# EAGLE schematic PinHeck (EAGLE 6.5.0)
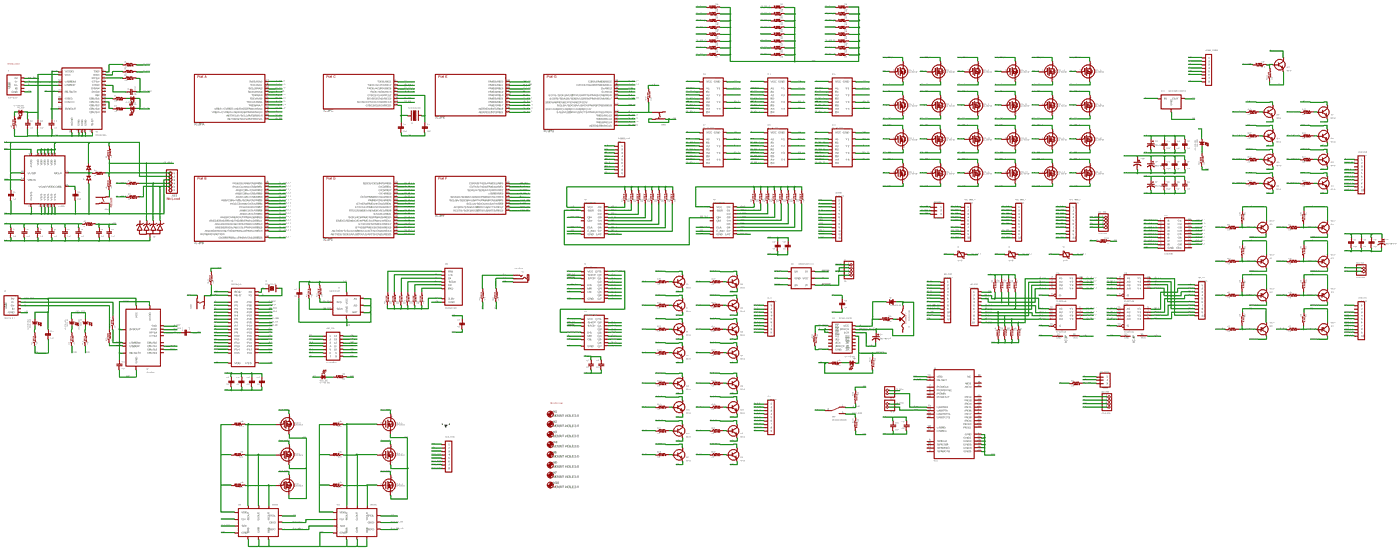
[diagram p0: schematic, sheet 1, overview]
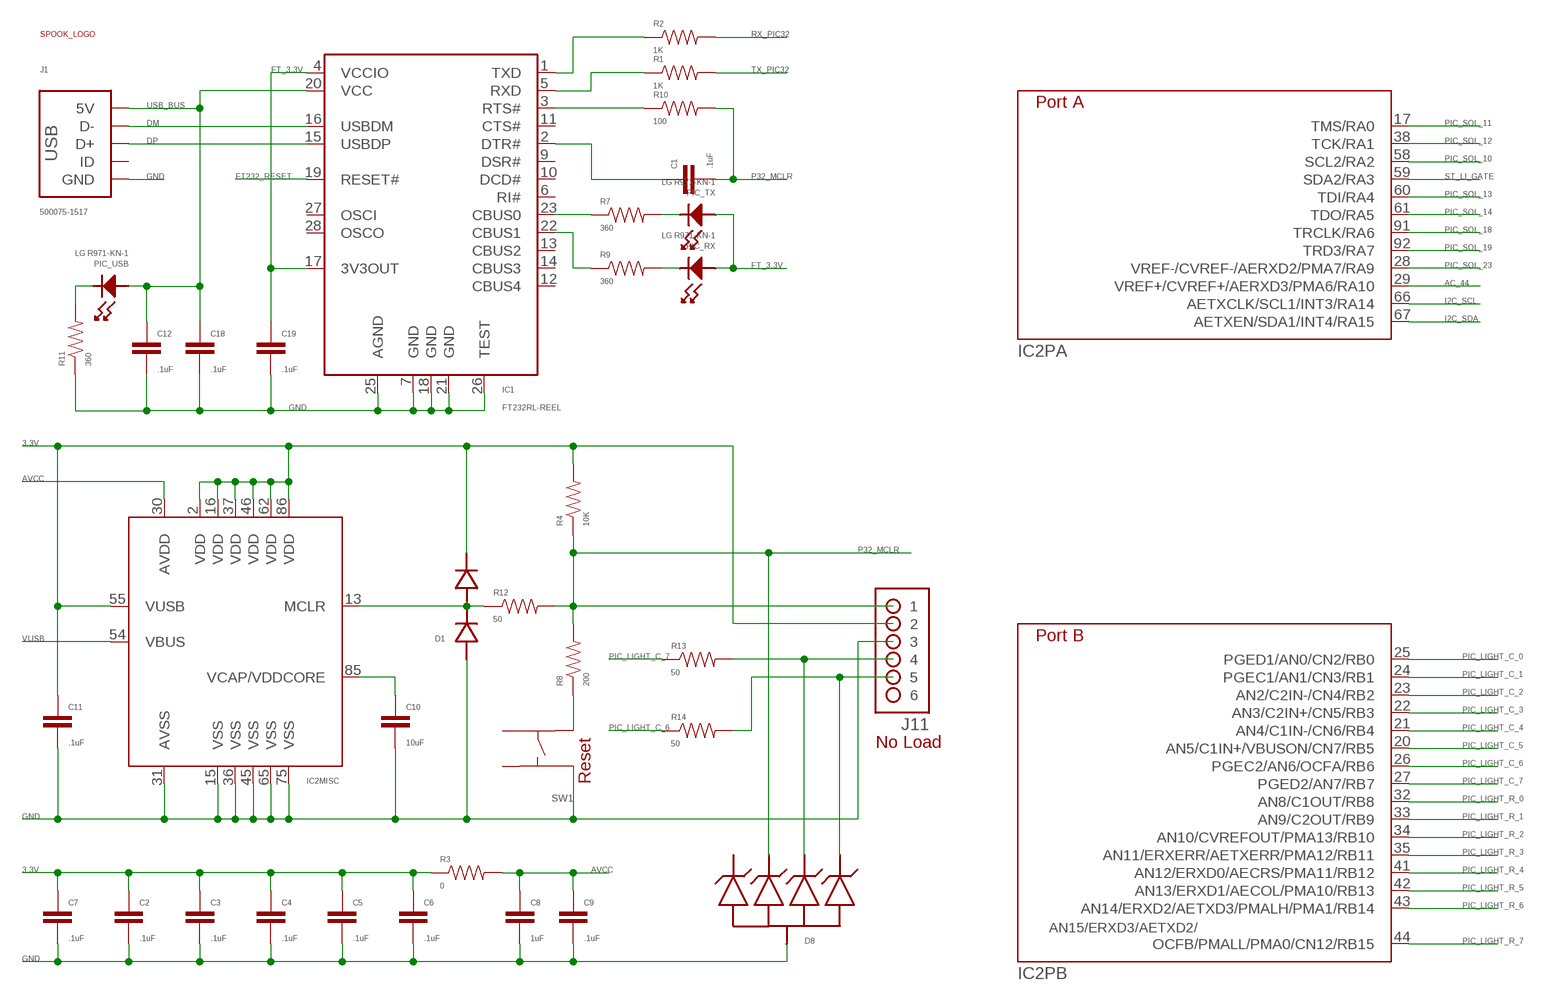
[diagram p1: schematic, sheet 1, part 1 of 9]
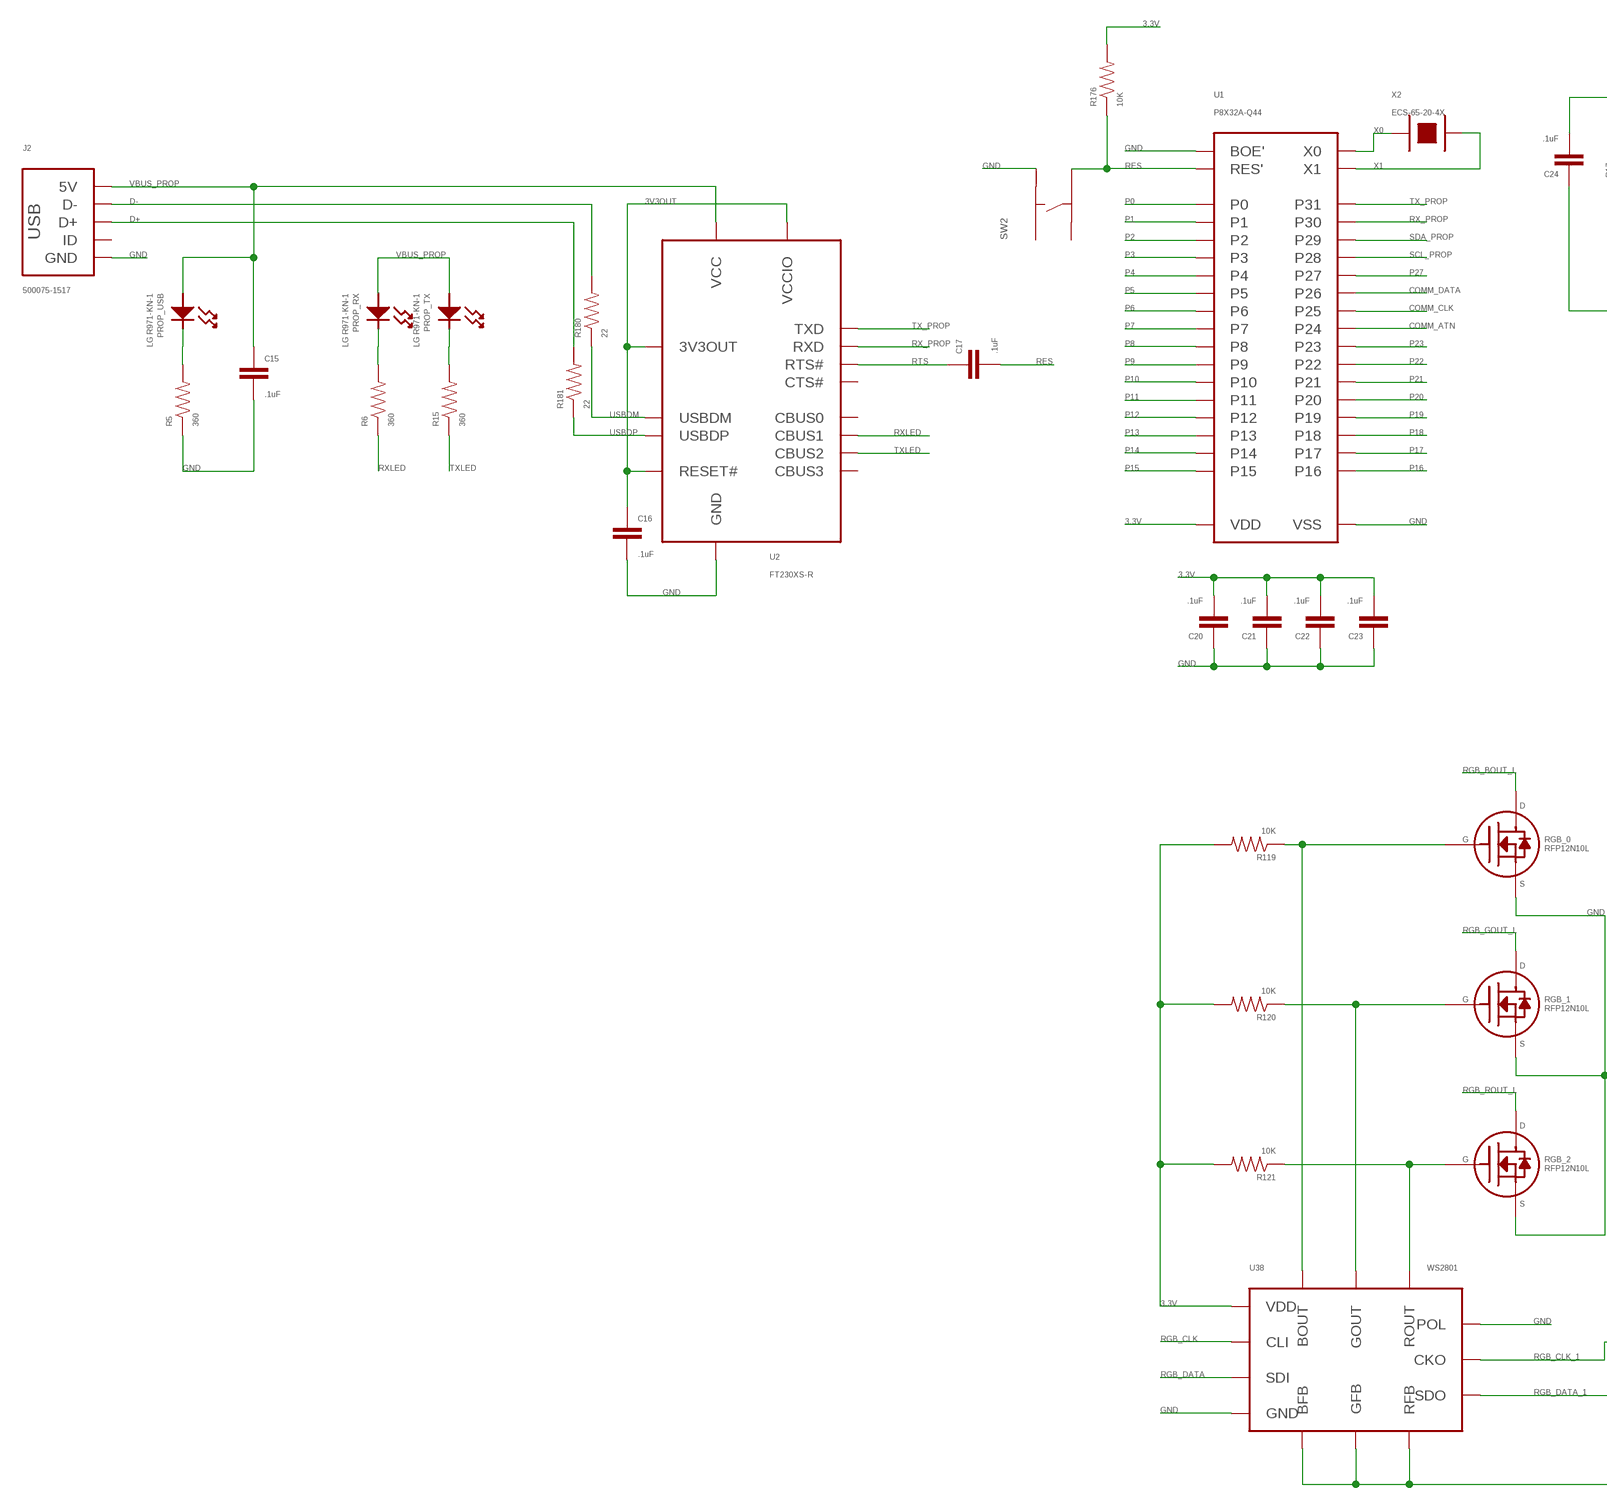
[diagram p2: schematic, sheet 1, part 2 of 9]
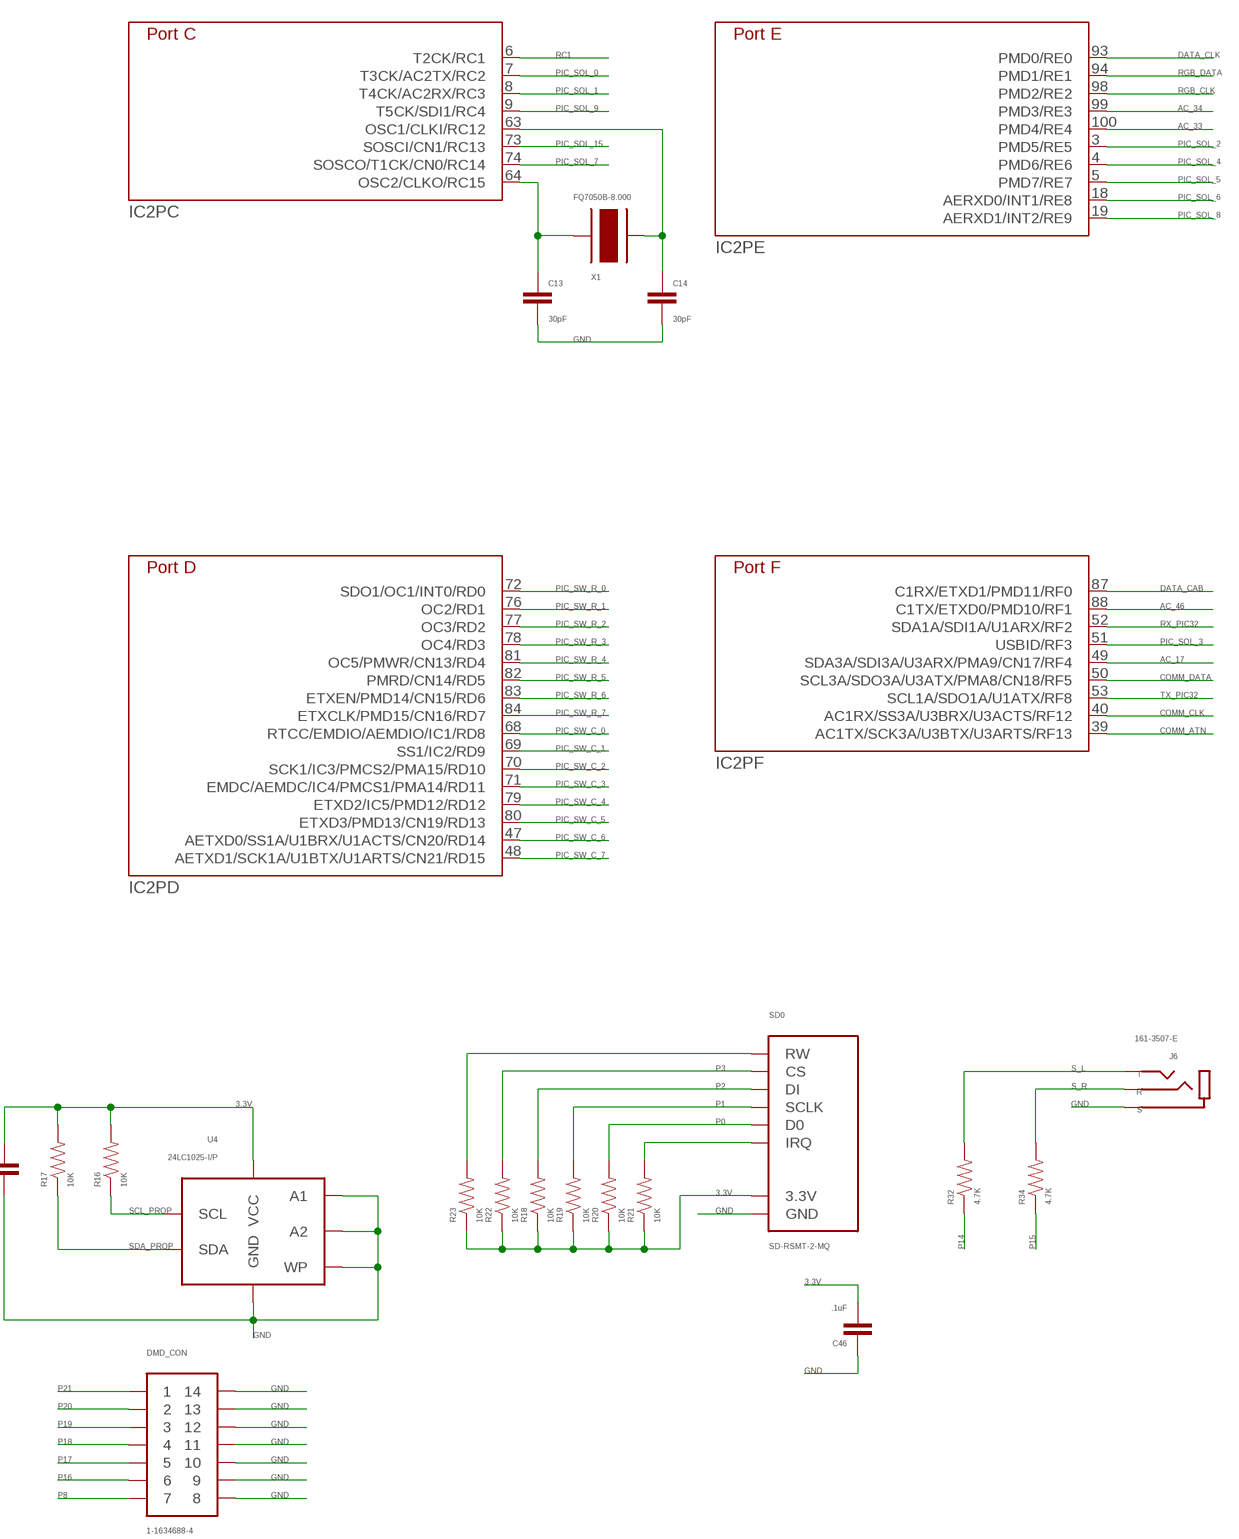
[diagram p3: schematic, sheet 1, part 3 of 9]
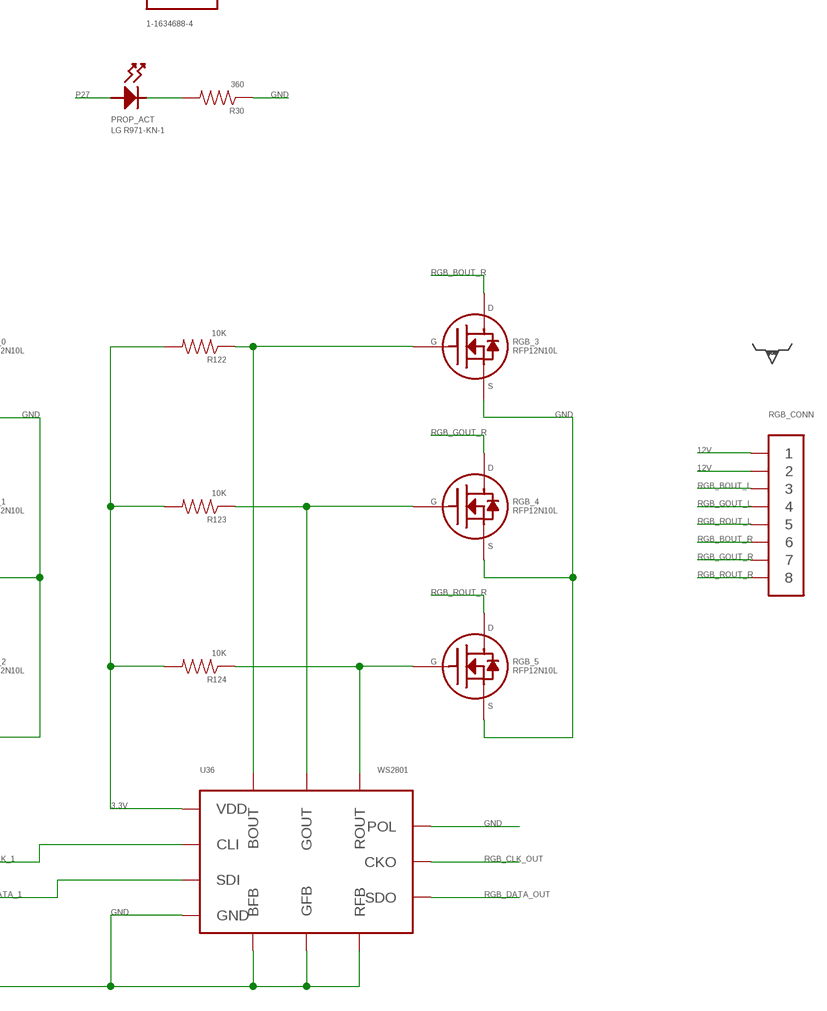
[diagram p4: schematic, sheet 1, part 4 of 9]
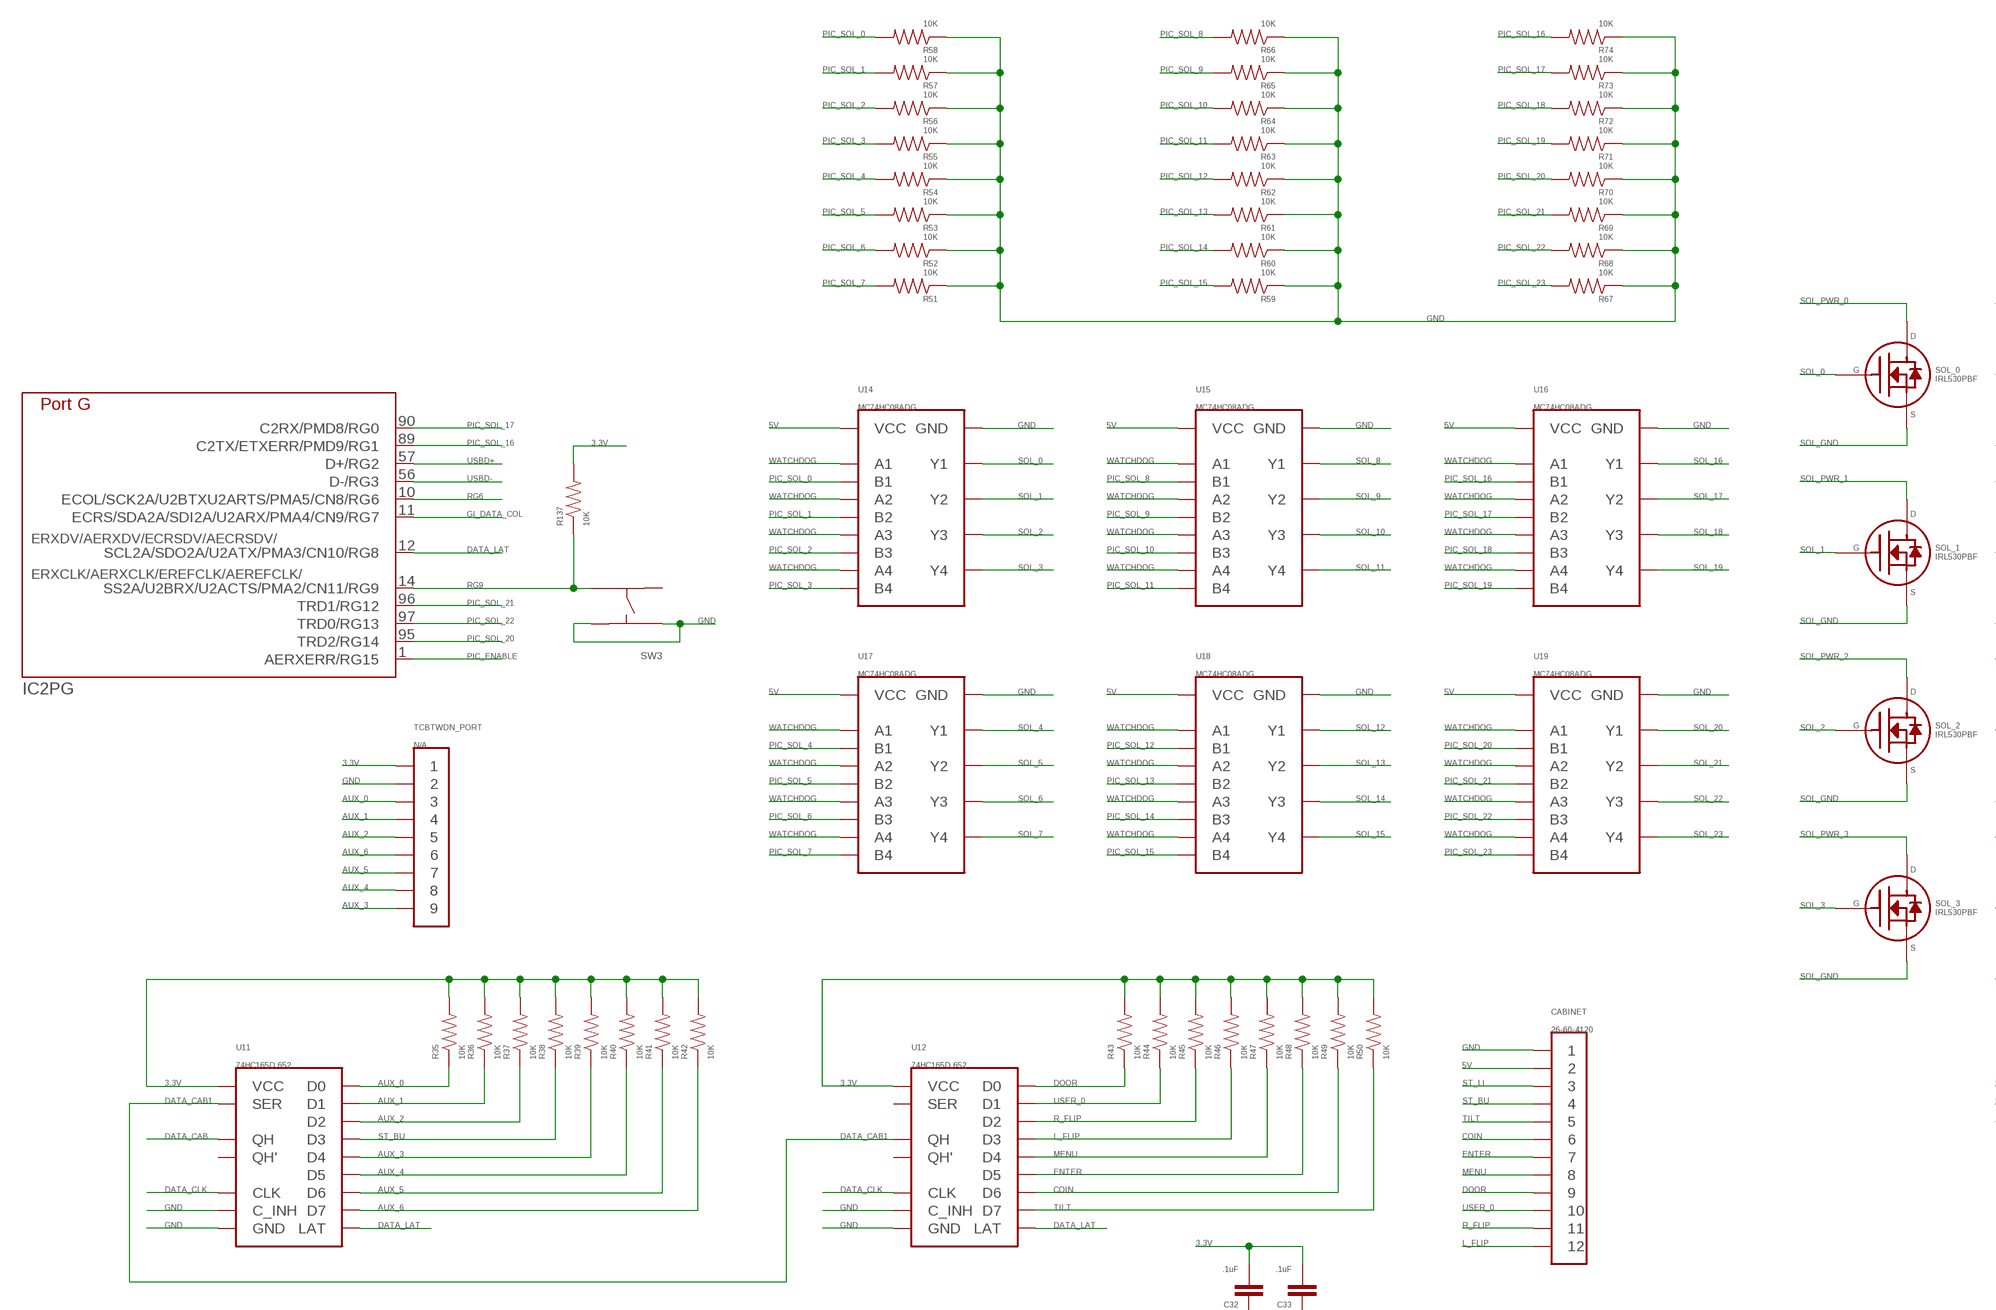
[diagram p5: schematic, sheet 1, part 5 of 9]
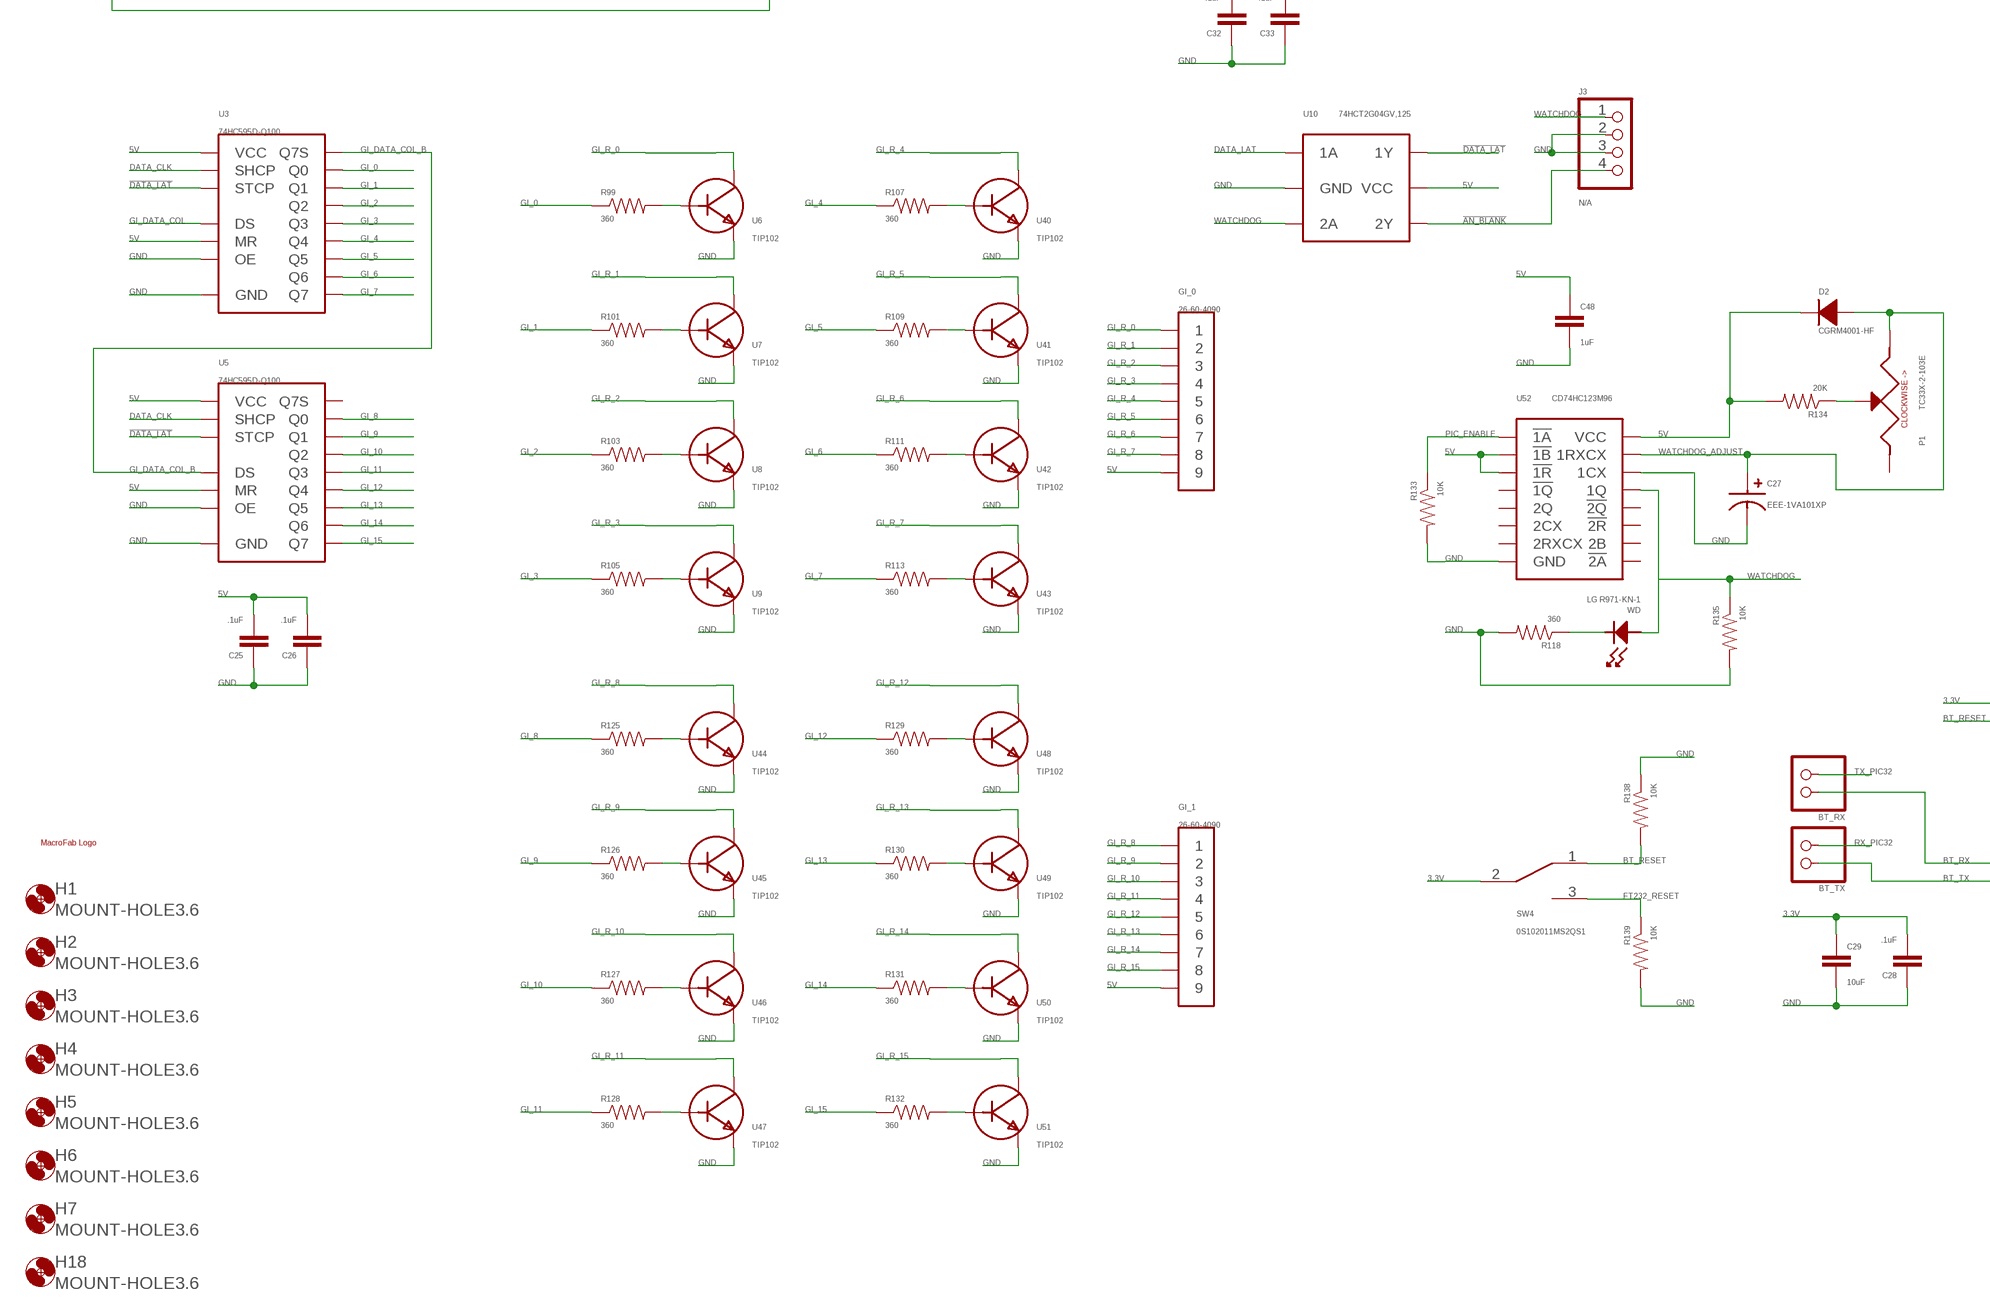
[diagram p6: schematic, sheet 1, part 6 of 9]
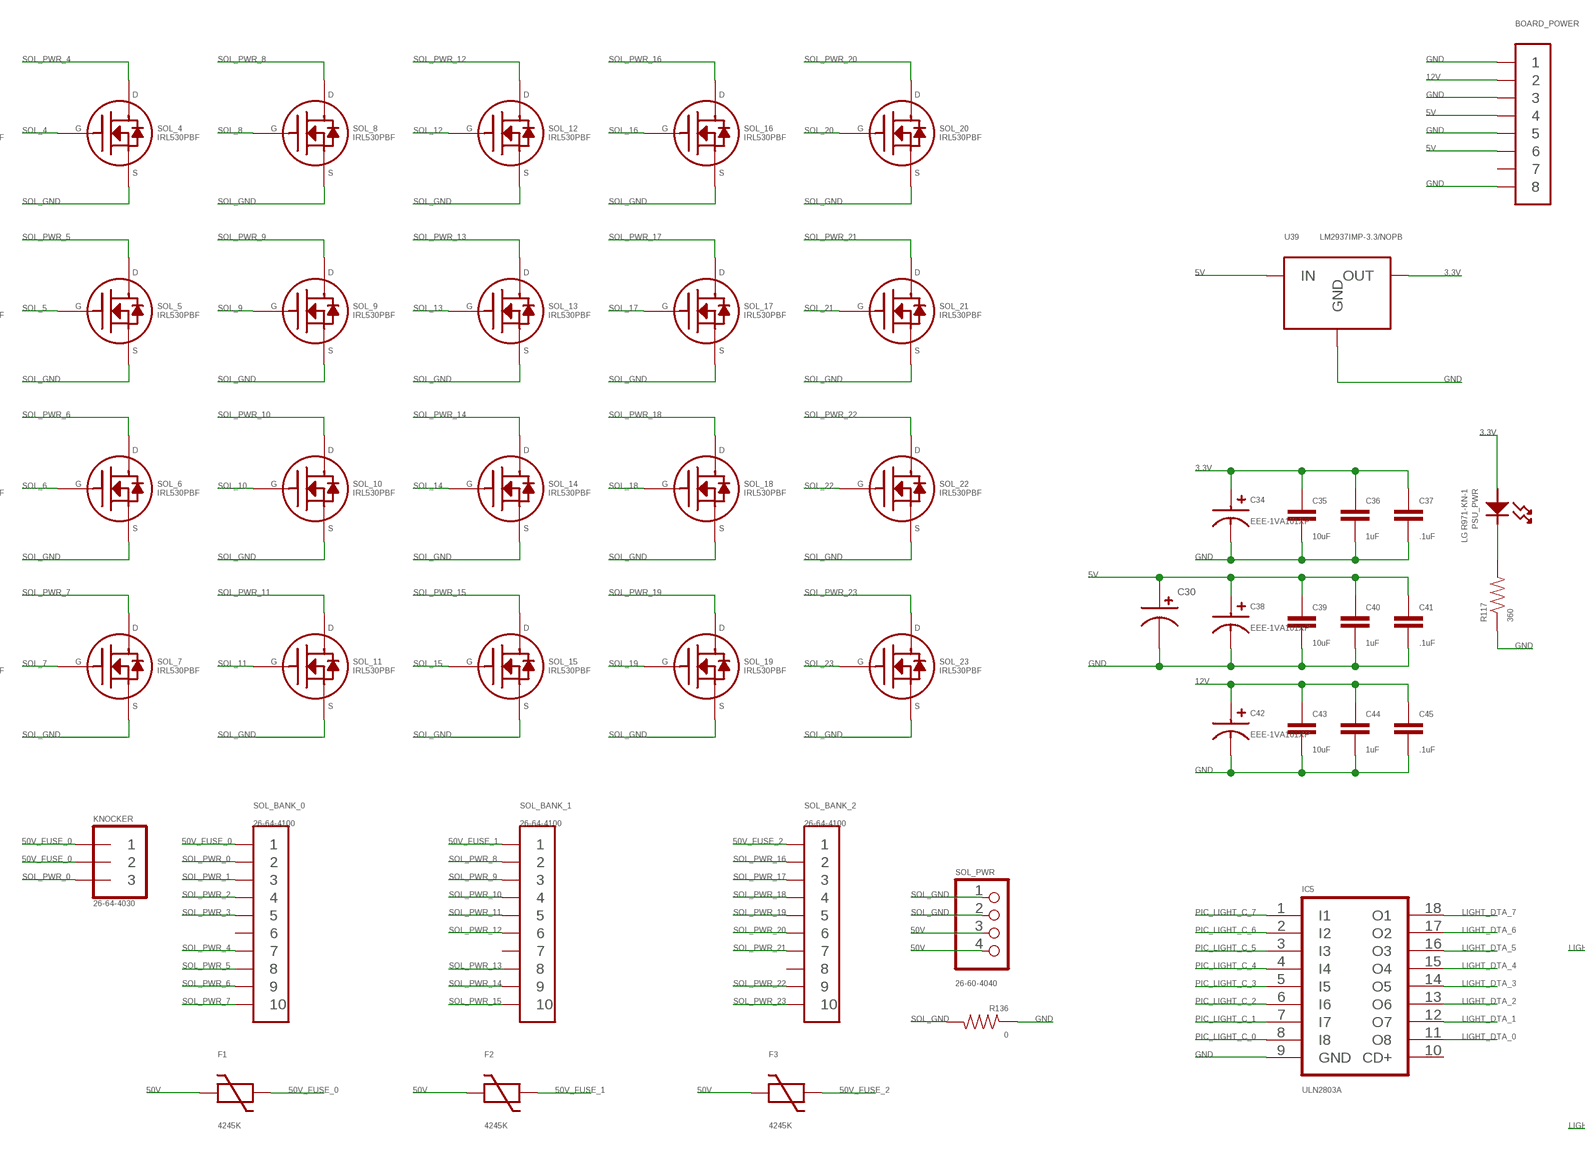
[diagram p7: schematic, sheet 1, part 7 of 9]
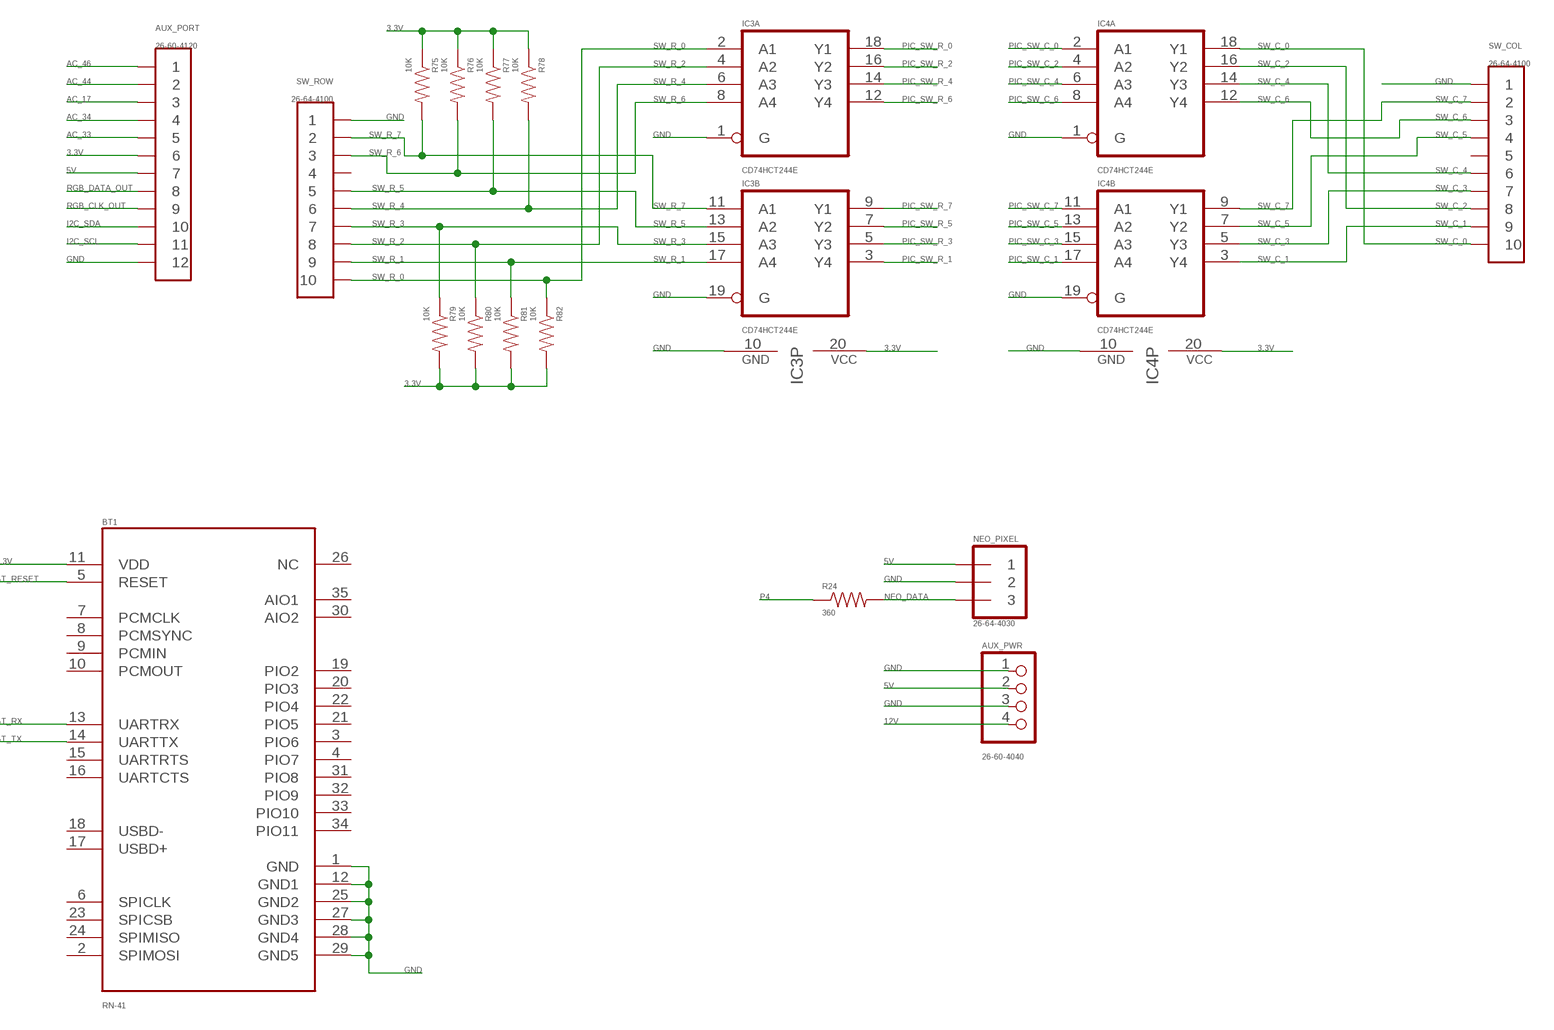
[diagram p8: schematic, sheet 1, part 8 of 9]
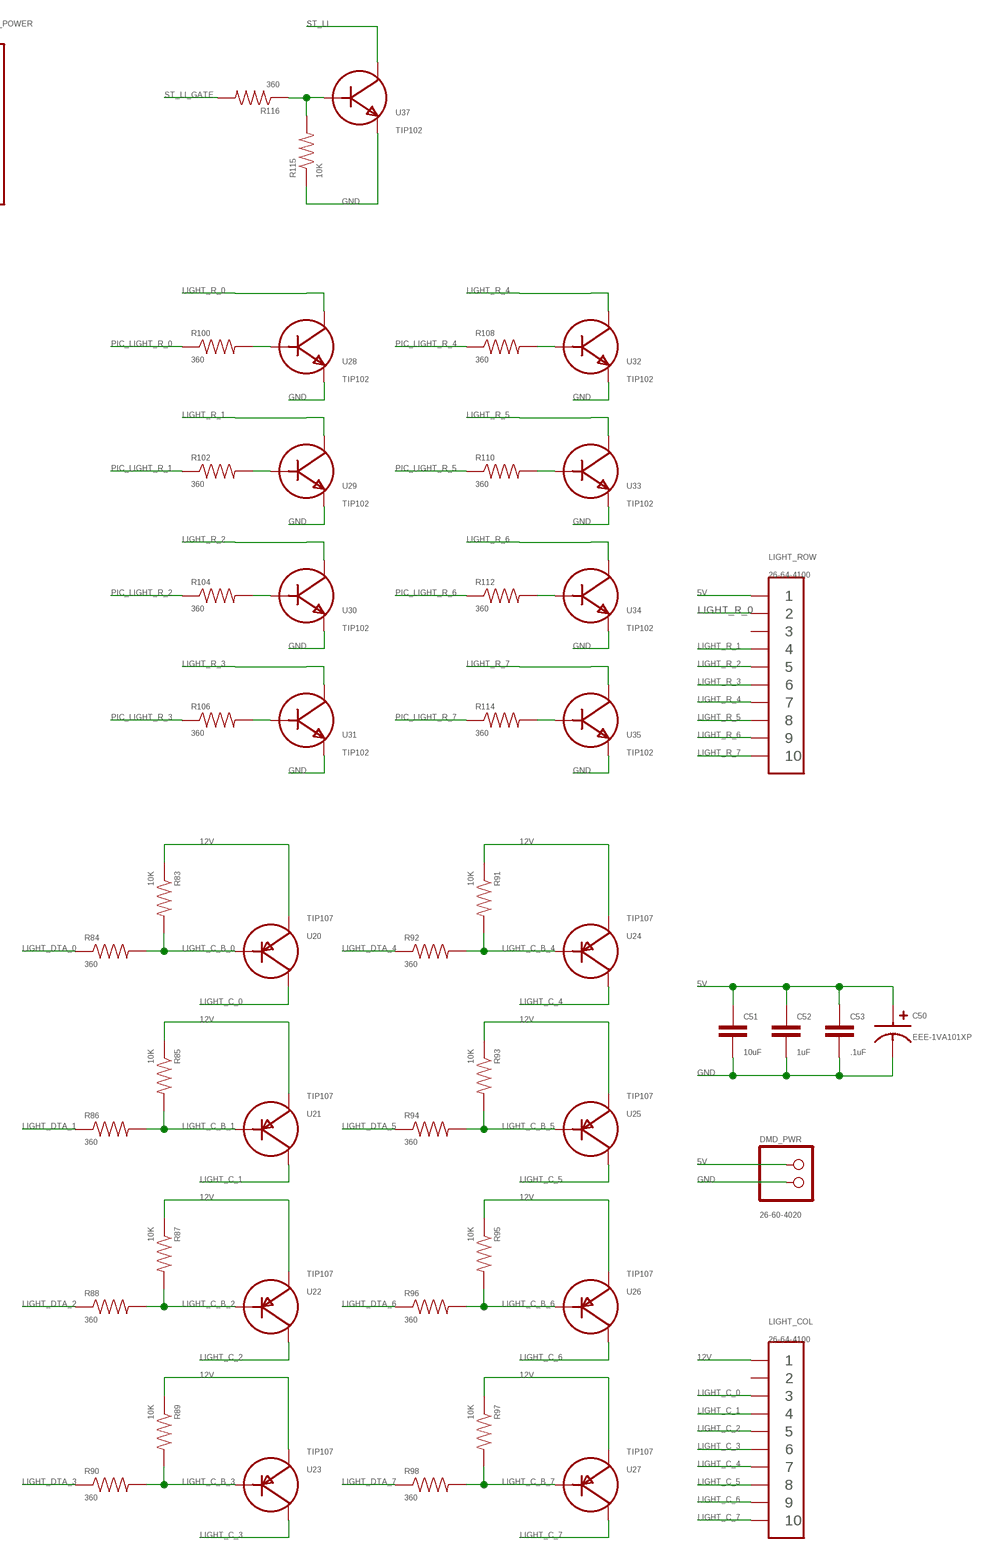
[diagram p9: schematic, sheet 1, part 9 of 9]

## Parts
AUX_PORT  26-60-4120  PH_1X12KK_12  [MOLEX_KK_12]
AUX_PWR  26-60-4040  PH_1X04KK_4  [MOLEX_KK_4]
BOARD_POWER  PH_1X08MOLEX_KK_8  [MOLEX_KK_8]
BT1  RN-41  RN-41RN-41  [RN-41]
BT_RX  PH_1X02HEADER_PTH  [HEADER_01X02_PTH]
BT_TX  PH_1X02HEADER_PTH  [HEADER_01X02_PTH]
C1  .1uF  CAPACITOR_NON_POLAR0805  [0805]
C2  .1uF  CAPACITOR_NON_POLAR0805  [0805]
C3  .1uF  CAPACITOR_NON_POLAR0805  [0805]
C4  .1uF  CAPACITOR_NON_POLAR0805  [0805]
C5  .1uF  CAPACITOR_NON_POLAR0805  [0805]
C6  .1uF  CAPACITOR_NON_POLAR0805  [0805]
C7  .1uF  CAPACITOR_NON_POLAR0805  [0805]
C8  1uF  CAPACITOR_NON_POLAR0805  [0805]
C9  .1uF  CAPACITOR_NON_POLAR0805  [0805]
C10  10uF  CAPACITOR_NON_POLAR1206  [1206]
C11  .1uF  CAPACITOR_NON_POLAR0805  [0805]
C12  .1uF  CAPACITOR_NON_POLAR0805  [0805]
C13  30pF  CAPACITOR_NON_POLAR0805  [0805]
C14  30pF  CAPACITOR_NON_POLAR0805  [0805]
C15  .1uF  CAPACITOR_NON_POLAR0805  [0805]
C16  .1uF  CAPACITOR_NON_POLAR0805  [0805]
C17  .1uF  CAPACITOR_NON_POLAR0805  [0805]
C18  .1uF  CAPACITOR_NON_POLAR0805  [0805]
C19  .1uF  CAPACITOR_NON_POLAR0805  [0805]
C20  .1uF  CAPACITOR_NON_POLAR0805  [0805]
C21  .1uF  CAPACITOR_NON_POLAR0805  [0805]
C22  .1uF  CAPACITOR_NON_POLAR0805  [0805]
C23  .1uF  CAPACITOR_NON_POLAR0805  [0805]
C24  .1uF  CAPACITOR_NON_POLAR0805  [0805]
C25  .1uF  CAPACITOR_NON_POLAR0805  [0805]
C26  .1uF  CAPACITOR_NON_POLAR0805  [0805]
C27  EEE-1VA101XP  CAPACITOR_POLARIZED6.3MM_SMD  [6.3MM_CAP_SMD]
C28  .1uF  CAPACITOR_NON_POLAR0805  [0805]
C29  10uF  CAPACITOR_NON_POLAR1206  [1206]
C30  CAPACITOR_P_12.5MM  [CP12.5MM]
C32  .1uF  CAPACITOR_NON_POLAR0805  [0805]
C33  .1uF  CAPACITOR_NON_POLAR0805  [0805]
C34  EEE-1VA101XP  CAPACITOR_POLARIZED6.3MM_SMD  [6.3MM_CAP_SMD]
C35  10uF  CAPACITOR_NON_POLAR1206  [1206]
C36  1uF  CAPACITOR_NON_POLAR0805  [0805]
C37  .1uF  CAPACITOR_NON_POLAR0805  [0805]
C38  EEE-1VA101XP  CAPACITOR_POLARIZED6.3MM_SMD  [6.3MM_CAP_SMD]
C39  10uF  CAPACITOR_NON_POLAR1206  [1206]
C40  1uF  CAPACITOR_NON_POLAR0805  [0805]
C41  .1uF  CAPACITOR_NON_POLAR0805  [0805]
C42  EEE-1VA101XP  CAPACITOR_POLARIZED6.3MM_SMD  [6.3MM_CAP_SMD]
C43  10uF  CAPACITOR_NON_POLAR1206  [1206]
C44  1uF  CAPACITOR_NON_POLAR0805  [0805]
C45  .1uF  CAPACITOR_NON_POLAR0805  [0805]
C46  .1uF  CAPACITOR_NON_POLAR0805  [0805]
C48  1uF  CAPACITOR_NON_POLAR0805  [0805]
C50  EEE-1VA101XP  CAPACITOR_POLARIZED6.3MM_SMD  [6.3MM_CAP_SMD]
C51  10uF  CAPACITOR_NON_POLAR1206  [1206]
C52  1uF  CAPACITOR_NON_POLAR0805  [0805]
C53  .1uF  CAPACITOR_NON_POLAR0805  [0805]
CABINET  26-60-4120  PH_1X12KK_12  [MOLEX_KK_12]
D1  BAV99W,115  BAV99W  [SOT-323]
D2  CGRM4001-HF  DIODESOD-123  [SOD-123]
D8  NSQA6V8AW5T2G  NSQA6V8  [SOT-323-5]
DMD_CON  1-1634688-4  PH_2X07PTH  [HEADER_02X07_PTH]
DMD_PWR  26-60-4020  PH_1X02MOLEX_26-61-4020  [MOLEX_KK_2]
F1  4245K  PTC_FUSE4245K  [4245K]
F2  4245K  PTC_FUSE4245K  [4245K]
F3  4245K  PTC_FUSE4245K  [4245K]
GI_0  26-60-4090  PH_1X09MOLEX_KK_9  [MOLEX_KK_9]
GI_1  26-60-4090  PH_1X09MOLEX_KK_9  [MOLEX_KK_9]
H1  MOUNT-HOLE3.6  [3,6]
H2  MOUNT-HOLE3.6  [3,6]
H3  MOUNT-HOLE3.6  [3,6]
H4  MOUNT-HOLE3.6  [3,6]
H5  MOUNT-HOLE3.6  [3,6]
H6  MOUNT-HOLE3.6  [3,6]
H7  MOUNT-HOLE3.6  [3,6]
H18  MOUNT-HOLE3.6  [3,6]
IC1  FT232RL-REEL  FT232RL  [SSOP28L]
IC2  PIC32MX795F512L-80I/PT  PIC32MX7X5FL-PT  [TQ100-PT]
IC3  CD74HCT244E  74LS244N  [DIL20]
IC4  CD74HCT244E  74LS244N  [DIL20]
IC5  ULN2803A  [DIL18]
J1  500075-1517  USB500075-1517  [500075-1517]
J2  500075-1517  USB500075-1517  [500075-1517]
J3  N/A  PH_1X04HEADER_PTH  [HEADER_01X04_PTH]
J6  161-3507-E  TRS_JACK161-3507-E  [161-3507-E]
J11  No Load  HDR-1X6-OFFSET  [HDR-1X6_OFFSET]
KNOCKER  26-64-4030  PH_1X03KK_3  [MOLEX_KK_3]
LIGHT_COL  26-64-4100  PH_1X10KK_10  [MOLEX_KK_10]
LIGHT_ROW  26-64-4100  PH_1X10KK_10  [MOLEX_KK_10]
LOGO1  SPOOKY_LOGOSPOOKY_LOGO  [SPOOKY_LOGO]
NEO_PIXEL  26-64-4030  PH_1X03KK_3  [MOLEX_KK_3]
P1  TC33X-2-103E  TC33X-1TC33X-1  [TC33_TRIMMER]
PIC_RX  LG R971-KN-1  LED_SINGLE0805  [LED_0805]
PIC_TX  LG R971-KN-1  LED_SINGLE0805  [LED_0805]
PIC_USB  LG R971-KN-1  LED_SINGLE0805  [LED_0805]
PROP_ACT  LG R971-KN-1  LED_SINGLE0805  [LED_0805]
PROP_RX  LG R971-KN-1  LED_SINGLE0805  [LED_0805]
PROP_TX  LG R971-KN-1  LED_SINGLE0805  [LED_0805]
PROP_USB  LG R971-KN-1  LED_SINGLE0805  [LED_0805]
PSU_PWR  LG R971-KN-1  LED_SINGLE0805  [LED_0805]
R1  1K  RESISTOR0805  [0805]
R2  1K  RESISTOR0805  [0805]
R3  0  RESISTOR0805  [0805]
R4  10K  RESISTOR0805  [0805]
R5  360  RESISTOR0805  [0805]
R6  360  RESISTOR0805  [0805]
R7  360  RESISTOR0805  [0805]
R8  200  RESISTOR0805  [0805]
R9  360  RESISTOR0805  [0805]
R10  100  RESISTOR0805  [0805]
R11  360  RESISTOR0805  [0805]
R12  50  RESISTOR0805  [0805]
R13  50  RESISTOR0805  [0805]
R14  50  RESISTOR0805  [0805]
R15  360  RESISTOR0805  [0805]
R16  10K  RESISTOR0805  [0805]
R17  10K  RESISTOR0805  [0805]
R18  10K  RESISTOR0805  [0805]
R19  10K  RESISTOR0805  [0805]
R20  10K  RESISTOR0805  [0805]
R21  10K  RESISTOR0805  [0805]
R22  10K  RESISTOR0805  [0805]
R23  10K  RESISTOR0805  [0805]
R24  360  RESISTOR0805  [0805]
R30  360  RESISTOR0805  [0805]
R32  4.7K  RESISTOR0805  [0805]
R34  4.7K  RESISTOR0805  [0805]
R35  10K  RESISTOR0805  [0805]
R36  10K  RESISTOR0805  [0805]
R37  10K  RESISTOR0805  [0805]
R38  10K  RESISTOR0805  [0805]
R39  10K  RESISTOR0805  [0805]
R40  10K  RESISTOR0805  [0805]
R41  10K  RESISTOR0805  [0805]
R42  10K  RESISTOR0805  [0805]
R43  10K  RESISTOR0805  [0805]
R44  10K  RESISTOR0805  [0805]
R45  10K  RESISTOR0805  [0805]
R46  10K  RESISTOR0805  [0805]
R47  10K  RESISTOR0805  [0805]
R48  10K  RESISTOR0805  [0805]
R49  10K  RESISTOR0805  [0805]
R50  10K  RESISTOR0805  [0805]
R51  10K  RESISTOR0805  [0805]
R52  10K  RESISTOR0805  [0805]
R53  10K  RESISTOR0805  [0805]
R54  10K  RESISTOR0805  [0805]
R55  10K  RESISTOR0805  [0805]
R56  10K  RESISTOR0805  [0805]
R57  10K  RESISTOR0805  [0805]
R58  10K  RESISTOR0805  [0805]
R59  10K  RESISTOR0805  [0805]
R60  10K  RESISTOR0805  [0805]
R61  10K  RESISTOR0805  [0805]
R62  10K  RESISTOR0805  [0805]
R63  10K  RESISTOR0805  [0805]
R64  10K  RESISTOR0805  [0805]
R65  10K  RESISTOR0805  [0805]
R66  10K  RESISTOR0805  [0805]
R67  10K  RESISTOR0805  [0805]
R68  10K  RESISTOR0805  [0805]
R69  10K  RESISTOR0805  [0805]
R70  10K  RESISTOR0805  [0805]
R71  10K  RESISTOR0805  [0805]
R72  10K  RESISTOR0805  [0805]
R73  10K  RESISTOR0805  [0805]
R74  10K  RESISTOR0805  [0805]
R75  10K  RESISTOR0805  [0805]
R76  10K  RESISTOR0805  [0805]
R77  10K  RESISTOR0805  [0805]
R78  10K  RESISTOR0805  [0805]
R79  10K  RESISTOR0805  [0805]
R80  10K  RESISTOR0805  [0805]
R81  10K  RESISTOR0805  [0805]
R82  10K  RESISTOR0805  [0805]
R83  10K  RESISTOR0805  [0805]
R84  360  RESISTOR0805  [0805]
R85  10K  RESISTOR0805  [0805]
R86  360  RESISTOR0805  [0805]
R87  10K  RESISTOR0805  [0805]
R88  360  RESISTOR0805  [0805]
R89  10K  RESISTOR0805  [0805]
R90  360  RESISTOR0805  [0805]
R91  10K  RESISTOR0805  [0805]
R92  360  RESISTOR0805  [0805]
R93  10K  RESISTOR0805  [0805]
R94  360  RESISTOR0805  [0805]
R95  10K  RESISTOR0805  [0805]
R96  360  RESISTOR0805  [0805]
R97  10K  RESISTOR0805  [0805]
R98  360  RESISTOR0805  [0805]
R99  360  RESISTOR0805  [0805]
R100  360  RESISTOR0805  [0805]
R101  360  RESISTOR0805  [0805]
R102  360  RESISTOR0805  [0805]
R103  360  RESISTOR0805  [0805]
R104  360  RESISTOR0805  [0805]
R105  360  RESISTOR0805  [0805]
R106  360  RESISTOR0805  [0805]
R107  360  RESISTOR0805  [0805]
R108  360  RESISTOR0805  [0805]
R109  360  RESISTOR0805  [0805]
R110  360  RESISTOR0805  [0805]
R111  360  RESISTOR0805  [0805]
R112  360  RESISTOR0805  [0805]
R113  360  RESISTOR0805  [0805]
R114  360  RESISTOR0805  [0805]
R115  10K  RESISTOR0805  [0805]
R116  360  RESISTOR0805  [0805]
R117  360  RESISTOR0805  [0805]
R118  360  RESISTOR0805  [0805]
R119  10K  RESISTOR0805  [0805]
R120  10K  RESISTOR0805  [0805]
R121  10K  RESISTOR0805  [0805]
R122  10K  RESISTOR0805  [0805]
R123  10K  RESISTOR0805  [0805]
R124  10K  RESISTOR0805  [0805]
R125  360  RESISTOR0805  [0805]
R126  360  RESISTOR0805  [0805]
R127  360  RESISTOR0805  [0805]
R128  360  RESISTOR0805  [0805]
R129  360  RESISTOR0805  [0805]
R130  360  RESISTOR0805  [0805]
R131  360  RESISTOR0805  [0805]
R132  360  RESISTOR0805  [0805]
R133  10K  RESISTOR0805  [0805]
R134  20K  RESISTOR0805  [0805]
R135  10K  RESISTOR0805  [0805]
R136  0  RESISTOR0805  [0805]
R137  10K  RESISTOR0805  [0805]
R138  10K  RESISTOR0805  [0805]
R139  10K  RESISTOR0805  [0805]
R176  10K  RESISTOR0805  [0805]
R180  22  RESISTOR0805  [0805]
R181  22  RESISTOR0805  [0805]
RGB_0  RFP12N10L  MOSFET_N-CHANNEL_SINGLETO-220AB  [TO-220AB]
RGB_1  RFP12N10L  MOSFET_N-CHANNEL_SINGLETO-220AB  [TO-220AB]
RGB_2  RFP12N10L  MOSFET_N-CHANNEL_SINGLETO-220AB  [TO-220AB]
RGB_3  RFP12N10L  MOSFET_N-CHANNEL_SINGLETO-220AB  [TO-220AB]
RGB_4  RFP12N10L  MOSFET_N-CHANNEL_SINGLETO-220AB  [TO-220AB]
RGB_5  RFP12N10L  MOSFET_N-CHANNEL_SINGLETO-220AB  [TO-220AB]
RGB_CONN  26-60-4080  PH_1X08MOLEX_KK_8  [MOLEX_KK_8]
SD0  SD-RSMT-2-MQ  SD_CARDSD-RSMT-2-MQ  [SD-RSMT-2-MQ]
SOL_0  IRL530PBF  MOSFET_N-CHANNEL_SINGLETO-220AB  [TO-220AB]
SOL_1  IRL530PBF  MOSFET_N-CHANNEL_SINGLETO-220AB  [TO-220AB]
SOL_2  IRL530PBF  MOSFET_N-CHANNEL_SINGLETO-220AB  [TO-220AB]
SOL_3  IRL530PBF  MOSFET_N-CHANNEL_SINGLETO-220AB  [TO-220AB]
SOL_4  IRL530PBF  MOSFET_N-CHANNEL_SINGLETO-220AB  [TO-220AB]
SOL_5  IRL530PBF  MOSFET_N-CHANNEL_SINGLETO-220AB  [TO-220AB]
SOL_6  IRL530PBF  MOSFET_N-CHANNEL_SINGLETO-220AB  [TO-220AB]
SOL_7  IRL530PBF  MOSFET_N-CHANNEL_SINGLETO-220AB  [TO-220AB]
SOL_8  IRL530PBF  MOSFET_N-CHANNEL_SINGLETO-220AB  [TO-220AB]
SOL_9  IRL530PBF  MOSFET_N-CHANNEL_SINGLETO-220AB  [TO-220AB]
SOL_10  IRL530PBF  MOSFET_N-CHANNEL_SINGLETO-220AB  [TO-220AB]
SOL_11  IRL530PBF  MOSFET_N-CHANNEL_SINGLETO-220AB  [TO-220AB]
SOL_12  IRL530PBF  MOSFET_N-CHANNEL_SINGLETO-220AB  [TO-220AB]
SOL_13  IRL530PBF  MOSFET_N-CHANNEL_SINGLETO-220AB  [TO-220AB]
SOL_14  IRL530PBF  MOSFET_N-CHANNEL_SINGLETO-220AB  [TO-220AB]
SOL_15  IRL530PBF  MOSFET_N-CHANNEL_SINGLETO-220AB  [TO-220AB]
SOL_16  IRL530PBF  MOSFET_N-CHANNEL_SINGLETO-220AB  [TO-220AB]
SOL_17  IRL530PBF  MOSFET_N-CHANNEL_SINGLETO-220AB  [TO-220AB]
SOL_18  IRL530PBF  MOSFET_N-CHANNEL_SINGLETO-220AB  [TO-220AB]
SOL_19  IRL530PBF  MOSFET_N-CHANNEL_SINGLETO-220AB  [TO-220AB]
SOL_20  IRL530PBF  MOSFET_N-CHANNEL_SINGLETO-220AB  [TO-220AB]
SOL_21  IRL530PBF  MOSFET_N-CHANNEL_SINGLETO-220AB  [TO-220AB]
SOL_22  IRL530PBF  MOSFET_N-CHANNEL_SINGLETO-220AB  [TO-220AB]
SOL_23  IRL530PBF  MOSFET_N-CHANNEL_SINGLETO-220AB  [TO-220AB]
SOL_BANK_0  26-64-4100  PH_1X10KK_10  [MOLEX_KK_10]
SOL_BANK_1  26-64-4100  PH_1X10KK_10  [MOLEX_KK_10]
SOL_BANK_2  26-64-4100  PH_1X10KK_10  [MOLEX_KK_10]
SOL_PWR  26-60-4040  PH_1X04KK_4  [MOLEX_KK_4]
SW1  TACT_6MM  [TACT6MM]
SW2  TACT_6MM  [TACT6MM]
SW3  TACT_6MM  [TACT6MM]
SW4  0S102011MS2QS1  SPDT0S102011MS2QS1  [0S102011MS2QS1]
SW_COL  26-64-4100  PH_1X10KK_10  [MOLEX_KK_10]
SW_ROW  26-64-4100  PH_1X10KK_10  [MOLEX_KK_10]
TCBTWDN_PORT  N/A  PH_1X09PTH  [HEADER_01X09_PTH]
U1  P8X32A-Q44  P8X32A_PROPELLERLQFP-44  [LQFP-44]
U2  FT230XS-R  FT230XSSOP-16  [SSOP-16]
U3  74HC595D-Q100  74HC595SO-16  [SO-16]
U4  24LC1025-I/P  CAT24M01XI-T2DIP-8  [DIP-8]
U5  74HC595D-Q100  74HC595SO-16  [SO-16]
U6  TIP102  BJT_NPN_SINGLETO-220  [TO-220AB]
U7  TIP102  BJT_NPN_SINGLETO-220  [TO-220AB]
U8  TIP102  BJT_NPN_SINGLETO-220  [TO-220AB]
U9  TIP102  BJT_NPN_SINGLETO-220  [TO-220AB]
U10  74HCT2G04GV,125  74HCT2G04GV,125TTSOP-6  [TTSOP-6]
U11  74HC165D,652  74HC165SO-16  [SO-16]
U12  74HC165D,652  74HC165SO-16  [SO-16]
U14  MC74HC08ADG  MC74HC08ADGSOIC-14  [SOIC-14]
U15  MC74HC08ADG  MC74HC08ADGSOIC-14  [SOIC-14]
U16  MC74HC08ADG  MC74HC08ADGSOIC-14  [SOIC-14]
U17  MC74HC08ADG  MC74HC08ADGSOIC-14  [SOIC-14]
U18  MC74HC08ADG  MC74HC08ADGSOIC-14  [SOIC-14]
U19  MC74HC08ADG  MC74HC08ADGSOIC-14  [SOIC-14]
U20  TIP107  BJT_PNP_SINGLETO-220  [TO-220AB]
U21  TIP107  BJT_PNP_SINGLETO-220  [TO-220AB]
U22  TIP107  BJT_PNP_SINGLETO-220  [TO-220AB]
U23  TIP107  BJT_PNP_SINGLETO-220  [TO-220AB]
U24  TIP107  BJT_PNP_SINGLETO-220  [TO-220AB]
U25  TIP107  BJT_PNP_SINGLETO-220  [TO-220AB]
U26  TIP107  BJT_PNP_SINGLETO-220  [TO-220AB]
U27  TIP107  BJT_PNP_SINGLETO-220  [TO-220AB]
U28  TIP102  BJT_NPN_SINGLETO-220  [TO-220AB]
U29  TIP102  BJT_NPN_SINGLETO-220  [TO-220AB]
U30  TIP102  BJT_NPN_SINGLETO-220  [TO-220AB]
U31  TIP102  BJT_NPN_SINGLETO-220  [TO-220AB]
U32  TIP102  BJT_NPN_SINGLETO-220  [TO-220AB]
U33  TIP102  BJT_NPN_SINGLETO-220  [TO-220AB]
U34  TIP102  BJT_NPN_SINGLETO-220  [TO-220AB]
U35  TIP102  BJT_NPN_SINGLETO-220  [TO-220AB]
U36  WS2801  WS2801SOP-14  [SOP-14]
U37  TIP102  BJT_NPN_SINGLETO-220  [TO-220AB]
U38  WS2801  WS2801SOP-14  [SOP-14]
U39  LM2937IMP-3.3/NOPB  FIXED_VOLTAGE_REGSOT-223  [SOT-223]
U40  TIP102  BJT_NPN_SINGLETO-220  [TO-220AB]
U41  TIP102  BJT_NPN_SINGLETO-220  [TO-220AB]
U42  TIP102  BJT_NPN_SINGLETO-220  [TO-220AB]
U43  TIP102  BJT_NPN_SINGLETO-220  [TO-220AB]
U44  TIP102  BJT_NPN_SINGLETO-220  [TO-220AB]
U45  TIP102  BJT_NPN_SINGLETO-220  [TO-220AB]
U46  TIP102  BJT_NPN_SINGLETO-220  [TO-220AB]
U47  TIP102  BJT_NPN_SINGLETO-220  [TO-220AB]
U48  TIP102  BJT_NPN_SINGLETO-220  [TO-220AB]
U49  TIP102  BJT_NPN_SINGLETO-220  [TO-220AB]
U50  TIP102  BJT_NPN_SINGLETO-220  [TO-220AB]
U51  TIP102  BJT_NPN_SINGLETO-220  [TO-220AB]
U52  CD74HC123M96  74HC123SOIC-16  [SOIC-16]
U$1  LHE_LOGOLHE_LOGO  [LHE_LOGO]
U$2  MF_LOGOLOGO_TEXT  [MF_LOGO_TEXT]
WD  LG R971-KN-1  LED_SINGLE0805  [LED_0805]
X1  FQ7050B-8.000  XTAL-FQ7050B  [FQ7050B]
X2  ECS-65-20-4X  CRYSTALHC-49/US_PTH  [HC-49/US_PTH]

## Nets
3.3V: AUX_PORT.P$6 BT1.11(VDD) C2.1 C3.1 C4.1 C5.1 C6.1 C7.1 C11.1 C20.2 C21.2 C22.2 C23.2 C24.2 C28.2 C29.1 C32.2 C33.2 C34.POS C35.1 C36.1 C37.1 C46.2 D1.2(AN) IC2.2(MISC:VDD) IC2.16(MISC:VDD) IC2.37(MISC:VDD) IC2.46(MISC:VDD) IC2.55(MISC:VUSB) IC2.62(MISC:VDD) IC2.86(MISC:VDD) IC3.20(P:VCC) IC4.20(P:VCC) J11.2 PSU_PWR.ANODE R3.1 R4.2 R16.2 R17.2 R18.1 R19.1 R20.1 R21.1 R22.1 R23.1 R35.2 R36.2 R37.2 R38.2 R39.2 R40.2 R41.2 R42.2 R43.2 R44.2 R45.2 R46.2 R47.2 R48.2 R49.2 R50.2 R75.1 R76.1 R77.1 R78.1 R79.2 R80.2 R81.2 R82.2 R119.2 R120.2 R121.2 R122.2 R123.2 R124.2 R137.2 R176.2 SD0.4(3.3V) SW4.2 TCBTWDN_PORT.1 U1.8(VDD) U1.18(VDD) U1.30(VDD) U1.40(VDD) U4.8(VCC) U11.16(VCC) U12.16(VCC) U36.14(VDD) U38.14(VDD) U39.OUT
3V3OUT: C16.1 U2.3(VCCIO) U2.10(3V3OUT) U2.11(RESET#)
5V: AUX_PORT.P$7 AUX_PWR.2 BOARD_POWER.4 BOARD_POWER.6 C25.2 C26.2 C30.P$1 C38.POS C39.1 C40.1 C41.1 C48.1 C50.POS C51.1 C52.1 C53.1 CABINET.P$2 D2.1(CATHODE) DMD_PWR.P$1 GI_0.P$9 GI_1.P$9 LIGHT_ROW.P$1 NEO_PIXEL.1 R134.2 U3.10(MR) U3.16(VCC) U5.10(MR) U5.16(VCC) U10.5(VCC) U14.14(VCC) U15.14(VCC) U16.14(VCC) U17.14(VCC) U18.14(VCC) U19.14(VCC) U39.IN U52.2(!1B) U52.3(!1R) U52.16(VCC)
12V: AUX_PWR.4 BOARD_POWER.2 C42.POS C43.1 C44.1 C45.1 LIGHT_COL.P$1 R83.1 R85.1 R87.1 R89.1 R91.1 R93.1 R95.1 R97.1 RGB_CONN.1 RGB_CONN.2 U20.S(EMITTER) U21.S(EMITTER) U22.S(EMITTER) U23.S(EMITTER) U24.S(EMITTER) U25.S(EMITTER) U26.S(EMITTER) U27.S(EMITTER)
50V: F1.1A F1.1B F2.1A F2.1B F3.1A F3.1B SOL_PWR.3 SOL_PWR.4
50V_FUSE_0: F1.2A F1.2B KNOCKER.1 KNOCKER.2 SOL_BANK_0.P$1
50V_FUSE_1: F2.2A F2.2B SOL_BANK_1.P$1
50V_FUSE_2: F3.2A F3.2B SOL_BANK_2.P$1
!AN_BLANK: J3.4 U10.4(2Y)
!DATA_LAT: U3.12(STCP) U5.12(STCP) U10.6(1Y)
AC_17: AUX_PORT.P$3 IC2.49(PF:SDA3A/SDI3A/U3ARX/PMA9/CN17/RF4)
AC_33: AUX_PORT.P$5 IC2.100(PE:PMD4/RE4)
AC_34: AUX_PORT.P$4 IC2.99(PE:PMD3/RE3)
AC_44: AUX_PORT.P$2 IC2.29(PA:VREF+/CVREF+/AERXD3/PMA6/RA10)
AC_46: AUX_PORT.P$1 IC2.88(PF:C1TX/ETXD0/PMD10/RF1)
AUX_0: R35.1 TCBTWDN_PORT.3 U11.11(D0)
AUX_1: R36.1 TCBTWDN_PORT.4 U11.12(D1)
AUX_2: R37.1 TCBTWDN_PORT.5 U11.13(D2)
AUX_3: R39.1 TCBTWDN_PORT.9 U11.3(D4)
AUX_4: R40.1 TCBTWDN_PORT.8 U11.4(D5)
AUX_5: R41.1 TCBTWDN_PORT.7 U11.5(D6)
AUX_6: R42.1 TCBTWDN_PORT.6 U11.6(D7)
AVCC: C8.1 C9.1 IC2.30(MISC:AVDD) R3.2
BT_RESET: BT1.5(RESET) R138.2 SW4.1
BT_RX: BT1.13(UARTRX) BT_RX.1
BT_TX: BT1.14(UARTTX) BT_TX.1
COIN: CABINET.P$6 R49.1 U12.5(D6)
COMM_ATN: IC2.39(PF:AC1TX/SCK3A/U3BTX/U3ARTS/RF13) U1.31(P24)
COMM_CLK: IC2.40(PF:AC1RX/SS3A/U3BRX/U3ACTS/RF12) U1.32(P25)
COMM_DATA: IC2.50(PF:SCL3A/SDO3A/U3ATX/PMA8/CN18/RF5) U1.33(P26)
D1: PROP_USB.CATHODE R5.2
D2: PROP_RX.CATHODE R6.2
D3: PROP_TX.CATHODE R15.2
D+: J2.D+ R181.2
D-: J2.D- R180.2
DATA_CAB: IC2.87(PF:C1RX/ETXD1/PMD11/RF0) U11.9(QH)
DATA_CAB1: U11.10(SER) U12.9(QH)
DATA_CLK: IC2.93(PE:PMD0/RE0) U3.11(SHCP) U5.11(SHCP) U11.2(CLK) U12.2(CLK)
DATA_LAT: IC2.12(PG:SCL2A/SDO2A/U2ATX/PMA3/CN10/RG8) U10.1(1A) U11.1(LAT) U12.1(LAT)
DM: IC1.16(USBDM) J1.D-
DOOR: CABINET.P$9 R43.1 U12.11(D0)
DP: IC1.15(USBDP) J1.D+
ENTER: CABINET.P$7 R48.1 U12.4(D5)
FT232_RESET: IC1.19(RESET#) R139.1 SW4.3
FT_3.3V: C19.1 IC1.4(VCCIO) IC1.17(3V3OUT) PIC_RX.ANODE PIC_TX.ANODE
GI_0: R99.1 U3.15(Q0)
GI_1: R101.1 U3.1(Q1)
GI_2: R103.1 U3.2(Q2)
GI_3: R105.1 U3.3(Q3)
GI_4: R107.1 U3.4(Q4)
GI_5: R109.1 U3.5(Q5)
GI_6: R111.1 U3.6(Q6)
GI_7: R113.1 U3.7(Q7)
GI_8: R125.1 U5.15(Q0)
GI_9: R126.1 U5.1(Q1)
GI_10: R127.1 U5.2(Q2)
GI_11: R128.1 U5.3(Q3)
GI_12: R129.1 U5.4(Q4)
GI_13: R130.1 U5.5(Q5)
GI_14: R131.1 U5.6(Q6)
GI_15: R132.1 U5.7(Q7)
GI_DATA_COL: IC2.11(PG:ECRS/SDA2A/SDI2A/U2ARX/PMA4/CN9/RG7) U3.14(DS)
GI_DATA_COL_B: U3.9(Q7S) U5.14(DS)
GI_R_0: GI_0.P$1 U6.D(COLLECTOR)
GI_R_1: GI_0.P$2 U7.D(COLLECTOR)
GI_R_2: GI_0.P$3 U8.D(COLLECTOR)
GI_R_3: GI_0.P$4 U9.D(COLLECTOR)
GI_R_4: GI_0.P$5 U40.D(COLLECTOR)
GI_R_5: GI_0.P$6 U41.D(COLLECTOR)
GI_R_6: GI_0.P$7 U42.D(COLLECTOR)
GI_R_7: GI_0.P$8 U43.D(COLLECTOR)
GI_R_8: GI_1.P$1 U44.D(COLLECTOR)
GI_R_9: GI_1.P$2 U45.D(COLLECTOR)
GI_R_10: GI_1.P$3 U46.D(COLLECTOR)
GI_R_11: GI_1.P$4 U47.D(COLLECTOR)
GI_R_12: GI_1.P$5 U48.D(COLLECTOR)
GI_R_13: GI_1.P$6 U49.D(COLLECTOR)
GI_R_14: GI_1.P$7 U50.D(COLLECTOR)
GI_R_15: GI_1.P$8 U51.D(COLLECTOR)
GND: AUX_PORT.P$12 AUX_PWR.1 AUX_PWR.3 BOARD_POWER.1 BOARD_POWER.3 BOARD_POWER.5 BOARD_POWER.8 BT1.1(GND) BT1.12(GND1) BT1.25(GND2) BT1.27(GND3) BT1.28(GND4) BT1.29(GND5) C2.2 C3.2 C4.2 C5.2 C6.2 C7.2 C8.2 C9.2 C10.2 C11.2 C12.2 C13.2 C14.2 C15.2 C16.2 C18.2 C19.2 C20.1 C21.1 C22.1 C23.1 C24.1 C25.1 C26.1 C27.NEG C28.1 C29.2 C30.P$2 C32.1 C33.1 C34.NEG C35.2 C36.2 C37.2 C38.NEG C39.2 C40.2 C41.2 C42.NEG C43.2 C44.2 C45.2 C46.1 C48.2 C50.NEG C51.2 C52.2 C53.2 CABINET.P$1 D1.1(CAT) D8.2(COM) DMD_CON.8 DMD_CON.9 DMD_CON.10 DMD_CON.11 DMD_CON.12 DMD_CON.13 DMD_CON.14 DMD_PWR.P$2 IC1.7(GND) IC1.18(GND) IC1.21(GND) IC1.25(AGND) IC1.26(TEST) IC2.15(MISC:VSS) IC2.31(MISC:AVSS) IC2.36(MISC:VSS) IC2.45(MISC:VSS) IC2.65(MISC:VSS) IC2.75(MISC:VSS) IC3.1(A:G) IC3.10(P:GND) IC3.19(B:G) IC4.1(A:G) IC4.10(P:GND) IC4.19(B:G) IC5.9(GND) J1.GND J1.P$1(GND) J1.P$2(GND) J1.P$3(GND) J1.P$4(GND) J2.GND J2.P$1(GND) J2.P$2(GND) J2.P$3(GND) J2.P$4(GND) J3.2 J3.3 J6.1(S) J11.3 NEO_PIXEL.2 R5.1 R11.1 R30.1 R51.1 R52.1 R53.1 R54.1 R55.1 R56.1 R57.1 R58.1 R59.1 R60.1 R61.1 R62.1 R63.1 R64.1 R65.1 R66.1 R67.1 R68.1 R69.1 R70.1 R71.1 R72.1 R73.1 R74.1 R115.1 R117.1 R118.2 R133.2 R135.2 R136.1 R138.1 R139.2 RGB_0.S(SOURCE) RGB_1.S(SOURCE) RGB_2.S(SOURCE) RGB_3.S(SOURCE) RGB_4.S(SOURCE) RGB_5.S(SOURCE) SD0.3(GND) SD0.6(GND) SD0.GND_1(GND) SD0.GND_2(GND) SW1.P$1 SW2.P$2 SW3.P$1 SW3.P$2 SW_COL.P$1 SW_ROW.P$1 TCBTWDN_PORT.2 U1.5(VSS) U1.6(BOE') U1.17(VSS) U1.27(VSS) U1.39(VSS) U2.5(GND) U2.13(GND) U3.8(GND) U3.13(OE) U4.2(A1) U4.3(A2) U4.4(GND) U4.7(WP) U5.8(GND) U5.13(OE) U6.S(EMITTER) U7.S(EMITTER) U8.S(EMITTER) U9.S(EMITTER) U10.2(GND) U11.8(GND) U11.15(C_INH) U12.8(GND) U12.15(C_INH) U14.7(GND) U15.7(GND) U16.7(GND) U17.7(GND) U18.7(GND) U19.7(GND) U28.S(EMITTER) U29.S(EMITTER) U30.S(EMITTER) U31.S(EMITTER) U32.S(EMITTER) U33.S(EMITTER) U34.S(EMITTER) U35.S(EMITTER) U36.3(POL) U36.4(RFB) U36.5(GFB) U36.6(BFB) U36.7(GND) U37.S(EMITTER) U38.3(POL) U38.4(RFB) U38.5(GFB) U38.6(BFB) U38.7(GND) U39.COM1(GND) U39.COM2(GND) U40.S(EMITTER) U41.S(EMITTER) U42.S(EMITTER) U43.S(EMITTER) U44.S(EMITTER) U45.S(EMITTER) U46.S(EMITTER) U47.S(EMITTER) U48.S(EMITTER) U49.S(EMITTER) U50.S(EMITTER) U51.S(EMITTER) U52.8(GND) U52.14(1CX)
I2C_SCL: AUX_PORT.P$11 IC2.66(PA:AETXCLK/SCL1/INT3/RA14)
I2C_SDA: AUX_PORT.P$10 IC2.67(PA:AETXEN/SDA1/INT4/RA15)
L_FLIP: CABINET.P$12 R46.1 U12.14(D3)
LIGHT_C_0: LIGHT_COL.P$3 U20.D(COLLECTOR)
LIGHT_C_1: LIGHT_COL.P$4 U21.D(COLLECTOR)
LIGHT_C_2: LIGHT_COL.P$5 U22.D(COLLECTOR)
LIGHT_C_3: LIGHT_COL.P$6 U23.D(COLLECTOR)
LIGHT_C_4: LIGHT_COL.P$7 U24.D(COLLECTOR)
LIGHT_C_5: LIGHT_COL.P$8 U25.D(COLLECTOR)
LIGHT_C_6: LIGHT_COL.P$9 U26.D(COLLECTOR)
LIGHT_C_7: LIGHT_COL.P$10 U27.D(COLLECTOR)
LIGHT_C_B_0: R83.2 R84.2 U20.G(BASE)
LIGHT_C_B_1: R85.2 R86.2 U21.G(BASE)
LIGHT_C_B_2: R87.2 R88.2 U22.G(BASE)
LIGHT_C_B_3: R89.2 R90.2 U23.G(BASE)
LIGHT_C_B_4: R91.2 R92.2 U24.G(BASE)
LIGHT_C_B_5: R93.2 R94.2 U25.G(BASE)
LIGHT_C_B_6: R95.2 R96.2 U26.G(BASE)
LIGHT_C_B_7: R97.2 R98.2 U27.G(BASE)
LIGHT_DTA_0: IC5.11(O8) R84.1
LIGHT_DTA_1: IC5.12(O7) R86.1
LIGHT_DTA_2: IC5.13(O6) R88.1
LIGHT_DTA_3: IC5.14(O5) R90.1
LIGHT_DTA_4: IC5.15(O4) R92.1
LIGHT_DTA_5: IC5.16(O3) R94.1
LIGHT_DTA_6: IC5.17(O2) R96.1
LIGHT_DTA_7: IC5.18(O1) R98.1
LIGHT_R_0: LIGHT_ROW.P$2 U28.D(COLLECTOR)
LIGHT_R_1: LIGHT_ROW.P$4 U29.D(COLLECTOR)
LIGHT_R_2: LIGHT_ROW.P$5 U30.D(COLLECTOR)
LIGHT_R_3: LIGHT_ROW.P$6 U31.D(COLLECTOR)
LIGHT_R_4: LIGHT_ROW.P$7 U32.D(COLLECTOR)
LIGHT_R_5: LIGHT_ROW.P$8 U33.D(COLLECTOR)
LIGHT_R_6: LIGHT_ROW.P$9 U34.D(COLLECTOR)
LIGHT_R_7: LIGHT_ROW.P$10 U35.D(COLLECTOR)
MENU: CABINET.P$8 R47.1 U12.3(D4)
N$1: PIC_RX.CATHODE R9.2
N$2: PIC_TX.CATHODE R7.2
N$3: PROP_ACT.CATHODE R30.2
N$4: IC1.1(TXD) R2.1
N$5: C10.1 IC2.85(MISC:VCAP/VDDCORE)
N$6: IC1.5(RXD) R1.1
N$7: IC1.22(CBUS1) R9.1
N$8: C1.1 IC1.2(DTR#)
N$9: R8.1 SW1.P$3
N$11: IC1.23(CBUS0) R7.1
N$12: PIC_USB.CATHODE R11.2
N$13: R100.2 U28.G(BASE)
N$15: R102.2 U29.G(BASE)
N$19: R23.2 SD0.9(RW)
N$21: R104.2 U30.G(BASE)
N$22: R119.1 RGB_0.G(GATE) U38.8(BOUT)
N$23: R120.1 RGB_1.G(GATE) U38.9(GOUT)
N$24: R21.2 SD0.8(IRQ)
N$25: R121.1 RGB_2.G(GATE) U38.10(ROUT)
N$26: R124.1 RGB_5.G(GATE) U36.10(ROUT)
N$28: R123.1 RGB_4.G(GATE) U36.9(GOUT)
N$29: R122.1 RGB_3.G(GATE) U36.8(BOUT)
N$31: D8.4(D3) J11.4 R13.2
N$32: IC1.3(RTS#) R10.1
N$33: D8.5(D4) J11.5 R14.2
N$34: R106.2 U31.G(BASE)
N$37: C13.1 IC2.64(PC:OSC2/CLKO/RC15) X1.1
N$38: D1.3(COM) IC2.13(MISC:MCLR) R12.1
N$40: R108.2 U32.G(BASE)
N$41: C14.1 IC2.63(PC:OSC1/CLKI/RC12) X1.3
N$43: R110.2 U33.G(BASE)
N$45: R112.2 U34.G(BASE)
N$47: R114.2 U35.G(BASE)
N$49: R115.2 R116.1 U37.G(BASE)
N$50: R118.1 WD.CATHODE
N$51: PSU_PWR.CATHODE R117.2
N$481: R99.2 U6.G(BASE)
N$482: R101.2 U7.G(BASE)
N$483: R103.2 U8.G(BASE)
N$484: R105.2 U9.G(BASE)
N$485: R107.2 U40.G(BASE)
N$486: R109.2 U41.G(BASE)
N$487: R111.2 U42.G(BASE)
N$488: R113.2 U43.G(BASE)
N$489: R125.2 U44.G(BASE)
N$490: R126.2 U45.G(BASE)
N$491: R127.2 U46.G(BASE)
N$492: R128.2 U47.G(BASE)
N$493: R129.2 U48.G(BASE)
N$494: R130.2 U49.G(BASE)
N$495: R131.2 U50.G(BASE)
N$496: R132.2 U51.G(BASE)
N$497: P1.2(2_WIPER) R134.1
NEO_DATA: NEO_PIXEL.3 R24.2
P0: R20.2 SD0.7(D0) U1.41(P0)
P1: R19.2 SD0.5(SCLK) U1.42(P1)
P2: R18.2 SD0.2(DI) U1.43(P2)
P3: R22.2 SD0.1(CS) U1.44(P3)
P4: R24.1 U1.1(P4)
P5: U1.2(P5)
P6: U1.3(P6)
P7: U1.4(P7)
P8: DMD_CON.7 U1.9(P8)
P9: U1.10(P9)
P10: U1.11(P10)
P11: U1.12(P11)
P12: U1.13(P12)
P13: U1.14(P13)
P14: R32.1 U1.15(P14)
P15: R34.1 U1.16(P15)
P16: DMD_CON.6 U1.19(P16)
P17: DMD_CON.5 U1.20(P17)
P18: DMD_CON.4 U1.21(P18)
P19: DMD_CON.3 U1.22(P19)
P20: DMD_CON.2 U1.23(P20)
P21: DMD_CON.1 U1.24(P21)
P22: U1.25(P22)
P23: U1.26(P23)
P27: PROP_ACT.ANODE U1.34(P27)
P32_MCLR: C1.2 D8.3(D2) J11.1 R4.1 R8.2 R10.2 R12.2
PIC_ENABLE: IC2.1(PG:AERXERR/RG15) R133.1 U52.1(!1A)
PIC_LIGHT_C_0: IC2.25(PB:PGED1/AN0/CN2/RB0) IC5.8(I8)
PIC_LIGHT_C_1: IC2.24(PB:PGEC1/AN1/CN3/RB1) IC5.7(I7)
PIC_LIGHT_C_2: IC2.23(PB:AN2/C2IN-/CN4/RB2) IC5.6(I6)
PIC_LIGHT_C_3: IC2.22(PB:AN3/C2IN+/CN5/RB3) IC5.5(I5)
PIC_LIGHT_C_4: IC2.21(PB:AN4/C1IN-/CN6/RB4) IC5.4(I4)
PIC_LIGHT_C_5: IC2.20(PB:AN5/C1IN+/VBUSON/CN7/RB5) IC5.3(I3)
PIC_LIGHT_C_6: IC2.26(PB:PGEC2/AN6/OCFA/RB6) IC5.2(I2) R14.1
PIC_LIGHT_C_7: IC2.27(PB:PGED2/AN7/RB7) IC5.1(I1) R13.1
PIC_LIGHT_R_0: IC2.32(PB:AN8/C1OUT/RB8) R100.1
PIC_LIGHT_R_1: IC2.33(PB:AN9/C2OUT/RB9) R102.1
PIC_LIGHT_R_2: IC2.34(PB:AN10/CVREFOUT/PMA13/RB10) R104.1
PIC_LIGHT_R_3: IC2.35(PB:AN11/ERXERR/AETXERR/PMA12/RB11) R106.1
PIC_LIGHT_R_4: IC2.41(PB:AN12/ERXD0/AECRS/PMA11/RB12) R108.1
PIC_LIGHT_R_5: IC2.42(PB:AN13/ERXD1/AECOL/PMA10/RB13) R110.1
PIC_LIGHT_R_6: IC2.43(PB:AN14/ERXD2/AETXD3/PMALH/PMA1/RB14) R112.1
PIC_LIGHT_R_7: IC2.44(PB:OCFB/PMALL/PMA0/CN12/RB15) R114.1
PIC_SOL_0: IC2.7(PC:T3CK/AC2TX/RC2) R58.2 U14.2(B1)
PIC_SOL_1: IC2.8(PC:T4CK/AC2RX/RC3) R57.2 U14.5(B2)
PIC_SOL_2: IC2.3(PE:PMD5/RE5) R56.2 U14.10(B3)
PIC_SOL_3: IC2.51(PF:USBID/RF3) R55.2 U14.13(B4)
PIC_SOL_4: IC2.4(PE:PMD6/RE6) R54.2 U17.2(B1)
PIC_SOL_5: IC2.5(PE:PMD7/RE7) R53.2 U17.5(B2)
PIC_SOL_6: IC2.18(PE:AERXD0/INT1/RE8) R52.2 U17.10(B3)
PIC_SOL_7: IC2.74(PC:SOSCO/T1CK/CN0/RC14) R51.2 U17.13(B4)
PIC_SOL_8: IC2.19(PE:AERXD1/INT2/RE9) R66.2 U15.2(B1)
PIC_SOL_9: IC2.9(PC:T5CK/SDI1/RC4) R65.2 U15.5(B2)
PIC_SOL_10: IC2.58(PA:SCL2/RA2) R64.2 U15.10(B3)
PIC_SOL_11: IC2.17(PA:TMS/RA0) R63.2 U15.13(B4)
PIC_SOL_12: IC2.38(PA:TCK/RA1) R62.2 U18.2(B1)
PIC_SOL_13: IC2.60(PA:TDI/RA4) R61.2 U18.5(B2)
PIC_SOL_14: IC2.61(PA:TDO/RA5) R60.2 U18.10(B3)
PIC_SOL_15: IC2.73(PC:SOSCI/CN1/RC13) R59.2 U18.13(B4)
PIC_SOL_16: IC2.89(PG:C2TX/ETXERR/PMD9/RG1) R74.2 U16.2(B1)
PIC_SOL_17: IC2.90(PG:C2RX/PMD8/RG0) R73.2 U16.5(B2)
PIC_SOL_18: IC2.91(PA:TRCLK/RA6) R72.2 U16.10(B3)
PIC_SOL_19: IC2.92(PA:TRD3/RA7) R71.2 U16.13(B4)
PIC_SOL_20: IC2.95(PG:TRD2/RG14) R70.2 U19.2(B1)
PIC_SOL_21: IC2.96(PG:TRD1/RG12) R69.2 U19.5(B2)
PIC_SOL_22: IC2.97(PG:TRD0/RG13) R68.2 U19.10(B3)
PIC_SOL_23: IC2.28(PA:VREF-/CVREF-/AERXD2/PMA7/RA9) R67.2 U19.13(B4)
PIC_SW_C_0: IC2.68(PD:RTCC/EMDIO/AEMDIO/IC1/RD8) IC4.2(A:A1)
PIC_SW_C_1: IC2.69(PD:SS1/IC2/RD9) IC4.17(B:A4)
PIC_SW_C_2: IC2.70(PD:SCK1/IC3/PMCS2/PMA15/RD10) IC4.4(A:A2)
PIC_SW_C_3: IC2.71(PD:EMDC/AEMDC/IC4/PMCS1/PMA14/RD11) IC4.15(B:A3)
PIC_SW_C_4: IC2.79(PD:ETXD2/IC5/PMD12/RD12) IC4.6(A:A3)
PIC_SW_C_5: IC2.80(PD:ETXD3/PMD13/CN19/RD13) IC4.13(B:A2)
PIC_SW_C_6: IC2.47(PD:AETXD0/SS1A/U1BRX/U1ACTS/CN20/RD14) IC4.8(A:A4)
PIC_SW_C_7: IC2.48(PD:AETXD1/SCK1A/U1BTX/U1ARTS/CN21/RD15) IC4.11(B:A1)
PIC_SW_R_0: IC2.72(PD:SDO1/OC1/INT0/RD0) IC3.18(A:Y1)
PIC_SW_R_1: IC2.76(PD:OC2/RD1) IC3.3(B:Y4)
PIC_SW_R_2: IC2.77(PD:OC3/RD2) IC3.16(A:Y2)
PIC_SW_R_3: IC2.78(PD:OC4/RD3) IC3.5(B:Y3)
PIC_SW_R_4: IC2.81(PD:OC5/PMWR/CN13/RD4) IC3.14(A:Y3)
PIC_SW_R_5: IC2.82(PD:PMRD/CN14/RD5) IC3.7(B:Y2)
PIC_SW_R_6: IC2.83(PD:ETXEN/PMD14/CN15/RD6) IC3.12(A:Y4)
PIC_SW_R_7: IC2.84(PD:ETXCLK/PMD15/CN16/RD7) IC3.9(B:Y1)
R_FLIP: CABINET.P$11 R45.1 U12.13(D2)
RC1: IC2.6(PC:T2CK/RC1)
RES: C17.2 R176.1 SW2.P$4 U1.7(RES')
RG6: IC2.10(PG:ECOL/SCK2A/U2BTXU2ARTS/PMA5/CN8/RG6)
RG9: IC2.14(PG:SS2A/U2BRX/U2ACTS/PMA2/CN11/RG9) R137.1 SW3.P$4
RGB_BOUT_L: RGB_0.D(DRAIN) RGB_CONN.3
RGB_BOUT_R: RGB_3.D(DRAIN) RGB_CONN.6
RGB_CLK: IC2.98(PE:PMD2/RE2) U38.1(CLI)
RGB_CLK_1: U36.1(CLI) U38.13(CKO)
RGB_CLK_OUT: AUX_PORT.P$9 U36.13(CKO)
RGB_DATA: IC2.94(PE:PMD1/RE1) U38.2(SDI)
RGB_DATA_1: U36.2(SDI) U38.12(SDO)
RGB_DATA_OUT: AUX_PORT.P$8 U36.12(SDO)
RGB_GOUT_L: RGB_1.D(DRAIN) RGB_CONN.4
RGB_GOUT_R: RGB_4.D(DRAIN) RGB_CONN.7
RGB_ROUT_L: RGB_2.D(DRAIN) RGB_CONN.5
RGB_ROUT_R: RGB_5.D(DRAIN) RGB_CONN.8
RTS: C17.1 U2.2(RTS#)
RX_PIC32: BT_TX.2 IC2.52(PF:SDA1A/SDI1A/U1ARX/RF2) R2.2
RX_PROP: U1.37(P30) U2.4(RXD)
RXLED: R6.1 U2.14(CBUS1)
S_L: J6.5(T) R32.2
S_R: J6.2(R) R34.2
SCL_PROP: R16.1 U1.35(P28) U4.6(SCL)
SDA_PROP: R17.1 U1.36(P29) U4.5(SDA)
SOL_0: SOL_0.G(GATE) U14.3(Y1)
SOL_1: SOL_1.G(GATE) U14.6(Y2)
SOL_2: SOL_2.G(GATE) U14.8(Y3)
SOL_3: SOL_3.G(GATE) U14.11(Y4)
SOL_4: SOL_4.G(GATE) U17.3(Y1)
SOL_5: SOL_5.G(GATE) U17.6(Y2)
SOL_6: SOL_6.G(GATE) U17.8(Y3)
SOL_7: SOL_7.G(GATE) U17.11(Y4)
SOL_8: SOL_8.G(GATE) U15.3(Y1)
SOL_9: SOL_9.G(GATE) U15.6(Y2)
SOL_10: SOL_10.G(GATE) U15.8(Y3)
SOL_11: SOL_11.G(GATE) U15.11(Y4)
SOL_12: SOL_12.G(GATE) U18.3(Y1)
SOL_13: SOL_13.G(GATE) U18.6(Y2)
SOL_14: SOL_14.G(GATE) U18.8(Y3)
SOL_15: SOL_15.G(GATE) U18.11(Y4)
SOL_16: SOL_16.G(GATE) U16.3(Y1)
SOL_17: SOL_17.G(GATE) U16.6(Y2)
SOL_18: SOL_18.G(GATE) U16.8(Y3)
SOL_19: SOL_19.G(GATE) U16.11(Y4)
SOL_20: SOL_20.G(GATE) U19.3(Y1)
SOL_21: SOL_21.G(GATE) U19.6(Y2)
SOL_22: SOL_22.G(GATE) U19.8(Y3)
SOL_23: SOL_23.G(GATE) U19.11(Y4)
SOL_GND: R136.2 SOL_0.S(SOURCE) SOL_1.S(SOURCE) SOL_2.S(SOURCE) SOL_3.S(SOURCE) SOL_4.S(SOURCE) SOL_5.S(SOURCE) SOL_6.S(SOURCE) SOL_7.S(SOURCE) SOL_8.S(SOURCE) SOL_9.S(SOURCE) SOL_10.S(SOURCE) SOL_11.S(SOURCE) SOL_12.S(SOURCE) SOL_13.S(SOURCE) SOL_14.S(SOURCE) SOL_15.S(SOURCE) SOL_16.S(SOURCE) SOL_17.S(SOURCE) SOL_18.S(SOURCE) SOL_19.S(SOURCE) SOL_20.S(SOURCE) SOL_21.S(SOURCE) SOL_22.S(SOURCE) SOL_23.S(SOURCE) SOL_PWR.1 SOL_PWR.2
SOL_PWR_0: KNOCKER.3 SOL_0.D(DRAIN) SOL_BANK_0.P$2
SOL_PWR_1: SOL_1.D(DRAIN) SOL_BANK_0.P$3
SOL_PWR_2: SOL_2.D(DRAIN) SOL_BANK_0.P$4
SOL_PWR_3: SOL_3.D(DRAIN) SOL_BANK_0.P$5
SOL_PWR_4: SOL_4.D(DRAIN) SOL_BANK_0.P$7
SOL_PWR_5: SOL_5.D(DRAIN) SOL_BANK_0.P$8
SOL_PWR_6: SOL_6.D(DRAIN) SOL_BANK_0.P$9
SOL_PWR_7: SOL_7.D(DRAIN) SOL_BANK_0.P$10
SOL_PWR_8: SOL_8.D(DRAIN) SOL_BANK_1.P$2
SOL_PWR_9: SOL_9.D(DRAIN) SOL_BANK_1.P$3
SOL_PWR_10: SOL_10.D(DRAIN) SOL_BANK_1.P$4
SOL_PWR_11: SOL_11.D(DRAIN) SOL_BANK_1.P$5
SOL_PWR_12: SOL_12.D(DRAIN) SOL_BANK_1.P$6
SOL_PWR_13: SOL_13.D(DRAIN) SOL_BANK_1.P$8
SOL_PWR_14: SOL_14.D(DRAIN) SOL_BANK_1.P$9
SOL_PWR_15: SOL_15.D(DRAIN) SOL_BANK_1.P$10
SOL_PWR_16: SOL_16.D(DRAIN) SOL_BANK_2.P$2
SOL_PWR_17: SOL_17.D(DRAIN) SOL_BANK_2.P$3
SOL_PWR_18: SOL_18.D(DRAIN) SOL_BANK_2.P$4
SOL_PWR_19: SOL_19.D(DRAIN) SOL_BANK_2.P$5
SOL_PWR_20: SOL_20.D(DRAIN) SOL_BANK_2.P$6
SOL_PWR_21: SOL_21.D(DRAIN) SOL_BANK_2.P$7
SOL_PWR_22: SOL_22.D(DRAIN) SOL_BANK_2.P$9
SOL_PWR_23: SOL_23.D(DRAIN) SOL_BANK_2.P$10
ST_BU: CABINET.P$4 R38.1 U11.14(D3)
ST_LI: CABINET.P$3 U37.D(COLLECTOR)
ST_LI_GATE: IC2.59(PA:SDA2/RA3) R116.2
SW_C_0: IC4.18(A:Y1) SW_COL.P$10
SW_C_1: IC4.3(B:Y4) SW_COL.P$9
SW_C_2: IC4.16(A:Y2) SW_COL.P$8
SW_C_3: IC4.5(B:Y3) SW_COL.P$7
SW_C_4: IC4.14(A:Y3) SW_COL.P$6
SW_C_5: IC4.7(B:Y2) SW_COL.P$4
SW_C_6: IC4.12(A:Y4) SW_COL.P$3
SW_C_7: IC4.9(B:Y1) SW_COL.P$2
SW_R_0: IC3.2(A:A1) R82.1 SW_ROW.P$10
SW_R_1: IC3.17(B:A4) R81.1 SW_ROW.P$9
SW_R_2: IC3.4(A:A2) R80.1 SW_ROW.P$8
SW_R_3: IC3.15(B:A3) R79.1 SW_ROW.P$7
SW_R_4: IC3.6(A:A3) R78.2 SW_ROW.P$6
SW_R_5: IC3.13(B:A2) R77.2 SW_ROW.P$5
SW_R_6: IC3.8(A:A4) R76.2 SW_ROW.P$3
SW_R_7: IC3.11(B:A1) R75.2 SW_ROW.P$2
TILT: CABINET.P$5 R50.1 U12.6(D7)
TX_PIC32: BT_RX.2 IC2.53(PF:SCL1A/SDO1A/U1ATX/RF8) R1.2
TX_PROP: U1.38(P31) U2.1(TXD)
TXLED: R15.1 U2.7(CBUS2)
USB_BUS: C12.1 C18.1 IC1.20(VCC) J1.5V PIC_USB.ANODE
USBD+: IC2.57(PG:D+/RG2)
USBD-: IC2.56(PG:D-/RG3)
USBDM: R180.1 U2.9(USBDM)
USBDP: R181.1 U2.8(USBDP)
USER_0: CABINET.P$10 R44.1 U12.12(D1)
VBUS_PROP: C15.1 J2.5V PROP_RX.ANODE PROP_TX.ANODE PROP_USB.ANODE U2.12(VCC)
VUSB: IC2.54(MISC:VBUS)
WATCHDOG: J3.1 R135.1 U10.3(2A) U14.1(A1) U14.4(A2) U14.9(A3) U14.12(A4) U15.1(A1) U15.4(A2) U15.9(A3) U15.12(A4) U16.1(A1) U16.4(A2) U16.9(A3) U16.12(A4) U17.1(A1) U17.4(A2) U17.9(A3) U17.12(A4) U18.1(A1) U18.4(A2) U18.9(A3) U18.12(A4) U19.1(A1) U19.4(A2) U19.9(A3) U19.12(A4) U52.13(1Q) WD.ANODE
WATCHDOG_ADJUST: C27.POS D2.2(ANODE) P1.3(3_CW) U52.15(1RXCX)
X0: U1.29(X0) X2.P$1
X1: U1.28(X1) X2.P$2
Unconnected: BOARD_POWER.7 BT1.2(SPIMOSI) BT1.3(PIO6) BT1.4(PIO7) BT1.6(SPICLK) BT1.7(PCMCLK) BT1.8(PCMSYNC) BT1.9(PCMIN) BT1.10(PCMOUT) BT1.15(UARTRTS) BT1.16(UARTCTS) BT1.17(USBD+) BT1.18(USBD-) BT1.19(PIO2) BT1.20(PIO3) BT1.21(PIO5) BT1.22(PIO4) BT1.23(SPICSB) BT1.24(SPIMISO) BT1.26(NC) BT1.30(AIO2) BT1.31(PIO8) BT1.32(PIO9) BT1.33(PIO10) BT1.34(PIO11) BT1.35(AIO1) D8.1(D1) IC1.6(RI#) IC1.9(DSR#) IC1.10(DCD#) IC1.11(CTS#) IC1.12(CBUS4) IC1.13(CBUS2) IC1.14(CBUS3) IC1.27(OSCI) IC1.28(OSCO) IC5.10(CD+) J1.ID J2.ID J11.6 LIGHT_COL.P$2 LIGHT_ROW.P$3 P1.1(1_CCW) SOL_BANK_0.P$6 SOL_BANK_1.P$7 SOL_BANK_2.P$8 SW1.P$2 SW1.P$4 SW2.P$1 SW2.P$3 SW3.P$3 SW_COL.P$5 SW_ROW.P$4 U2.6(CTS#) U2.15(CBUS0) U2.16(CBUS3) U5.9(Q7S) U11.7(QH') U12.7(QH') U12.10(SER) U52.4(!1Q) U52.5(2Q) U52.6(2CX) U52.7(2RXCX) U52.9(!2A) U52.10(2B) U52.11(!2R) U52.12(!2Q)

## Notes on the sheet
- FQ7050B-8.000
- No Load
- Reset

## Library data of the parts
AUX_PORT CABINET = PP_Connectors:PH_1X12
AUX_PWR J3 SOL_PWR = PP_Connectors:PH_1X04: 4 Pin Connectors
BOARD_POWER RGB_CONN = PP_Connectors:PH_1X08
BT1 = PP_Sensors:RN-41
BT_RX BT_TX DMD_PWR = PP_Connectors:PH_1X02: 2 pin connectors
C1-C26 C28 C29 C32 C33 C35-C37 C39-C41 C43-C46 C48 C51-C53 = PP_Passives:CAPACITOR_NON_POLAR: Capacitor Non Polarized
C27 C34 C38 C42 C50 = PP_Passives:CAPACITOR_POLARIZED: Polarized capacitors
C30 = MF_Passives:CAPACITOR_P: Library: MF_Passives Description: Device for Polarized Capacitors. Manufacture part number (MFG#), Voltage Rating, and Tolerance can be added via Attributes.; MFG#: N/A; TOLERANCE: N/A; VOLTAGE: N/A
D1 = Discrete:BAV99W: BAV99W Dual Surface Mount Switching Diode
D2 = PP_Passives:DIODE: Diode - Single
D8 = Discrete:NSQA6V8: Low Capacitance Quad ESD Protection Array
DMD_CON = PP_Connectors:PH_2X07
F1-F3 = PP_Passives:PTC_FUSE
GI_0 GI_1 TCBTWDN_PORT = PP_Connectors:PH_1X09
H1-H7 H18 = holes:MOUNT-HOLE: MOUNTING HOLE with drill center marker
IC1 = IC:FT232R: FTDI USB UART Serial Converter
IC2 = Microchip:PIC32MX7X5F*L: High Performance, USB, CAN and Ethernet 32-Bit Flash Microcontroller
IC3 IC4 = 74xx-us:74*244: Octal BUFFER and LINE DRIVER, 3-state
IC5 = uln-udn:ULN2803A: DRIVER ARRAY
J1 J2 = PP_Connectors:USB
J6 = PP_Connectors:TRS_JACK: TRS Jacks
J11 = Mechanical:HDR-1X6-OFFSET: 42 mil hole pattern with 16mil offset for jtag connector
KNOCKER NEO_PIXEL = PP_Connectors:PH_1X03: 3 pin connectors
LIGHT_COL LIGHT_ROW SOL_BANK_0 SOL_BANK_1 SOL_BANK_2 SW_COL SW_ROW = PP_Connectors:PH_1X10
LOGO1 = PP_Aesthetics:SPOOKY_LOGO
P1 = PP_Passives:TC33X-1
PIC_RX PIC_TX PIC_USB PROP_ACT PROP_RX PROP_TX PROP_USB PSU_PWR WD = PP_LED:LED_SINGLE
R1-R24 R30 R32 R34-R139 R176 R180 R181 = PP_Passives:RESISTOR: Resistors
RGB_0 RGB_1-RGB_5 SOL_0 SOL_1-SOL_23 = PP_DiscreteSemi:MOSFET_N-CHANNEL_SINGLE: Mosfet - N-Channel - Single
SD0 = PP_Connectors:SD_CARD
SW1-SW3 = MF_Switches:TACT: Library: MF_Switches Description: Device for Tact Switches. Manufacture part number (MFG#) can be added via Attributes.; MFG#: N/A
SW4 = PP_Electromechanical:SPDT
U1 = PP_DigitalIC:P8X32A_PROPELLER
U2 = PP_DigitalIC:FT230X: Manufacturer Part #: FT230XS-R Manufacturer: FTDI Description: USB Interface IC USB to Basic Serial UART IC SSOP-16
U3 U5 = PP_DigitalIC:74HC595
U4 = PP_DigitalIC:CAT24M01XI-T2
U6-U9 U28-U35 U37 U40-U51 = PP_DiscreteSemi:BJT_NPN_SINGLE: BJT NPN - Single
U10 = PP_DigitalIC:74HCT2G04GV,125
U11 U12 = PP_DigitalIC:74HC165
U14-U19 = PP_DigitalIC:MC74HC08ADG
U20-U27 = PP_DiscreteSemi:BJT_PNP_SINGLE
U36 U38 = PP_DigitalIC:WS2801
U39 = PP_PowerIC:FIXED_VOLTAGE_REG
U52 = PP_DigitalIC:74HC123
U$1 = PP_Aesthetics:LHE_LOGO
U$2 = PP_Aesthetics:MF_LOGO
X1 = Discrete:XTAL: Quartz Crystal
X2 = PP_FreqCtrl:CRYSTAL

## Net classes
0 default: width 0.178 mm, drill 0.5 mm, clearance 0.178 mm